# EAGLE design Main-v6.0 copy (EAGLE 9.5.2)
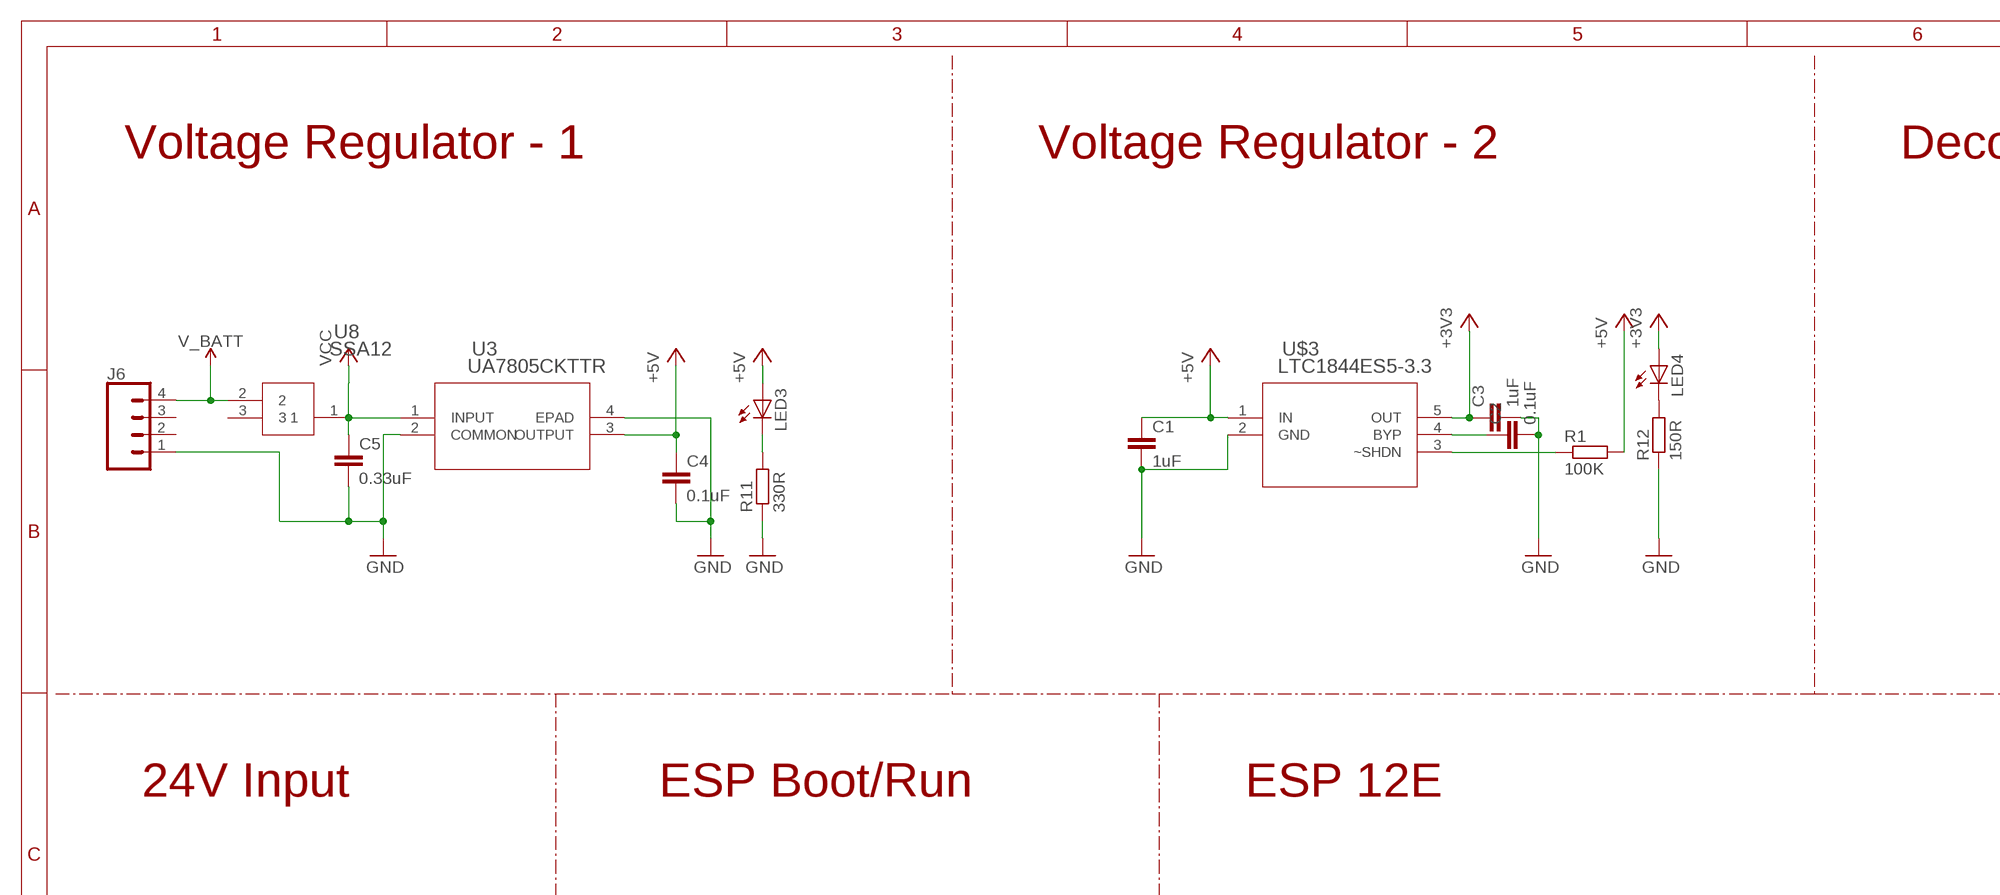
[diagram p0: schematic, sheet 1, part 1 of 3]
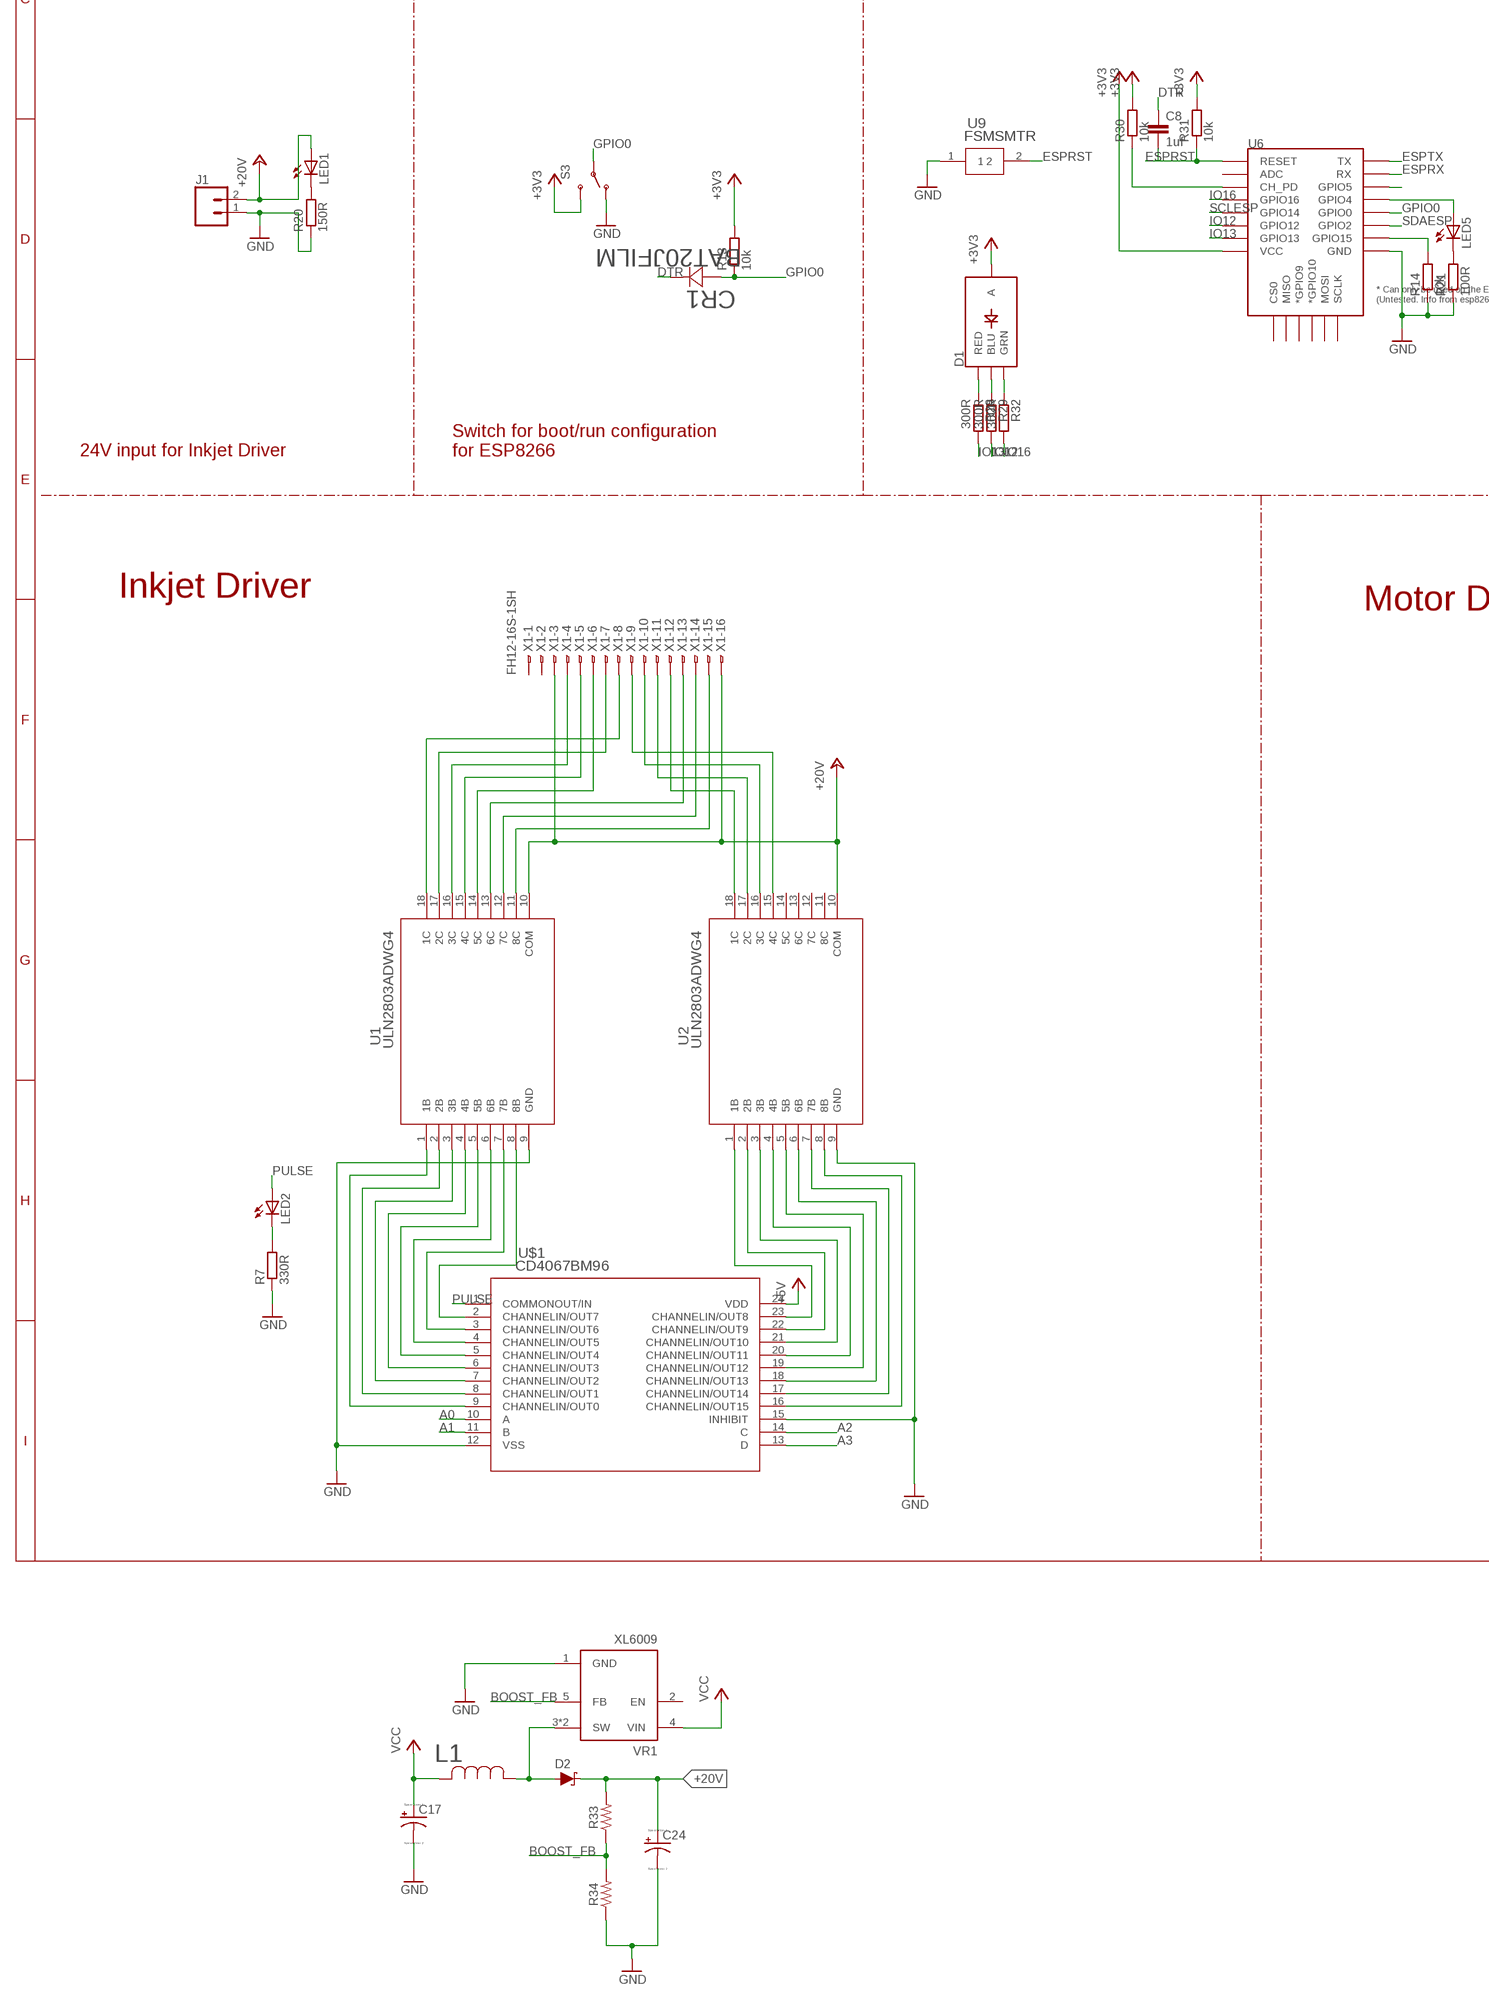
[diagram p1: schematic, sheet 1, part 2 of 3]
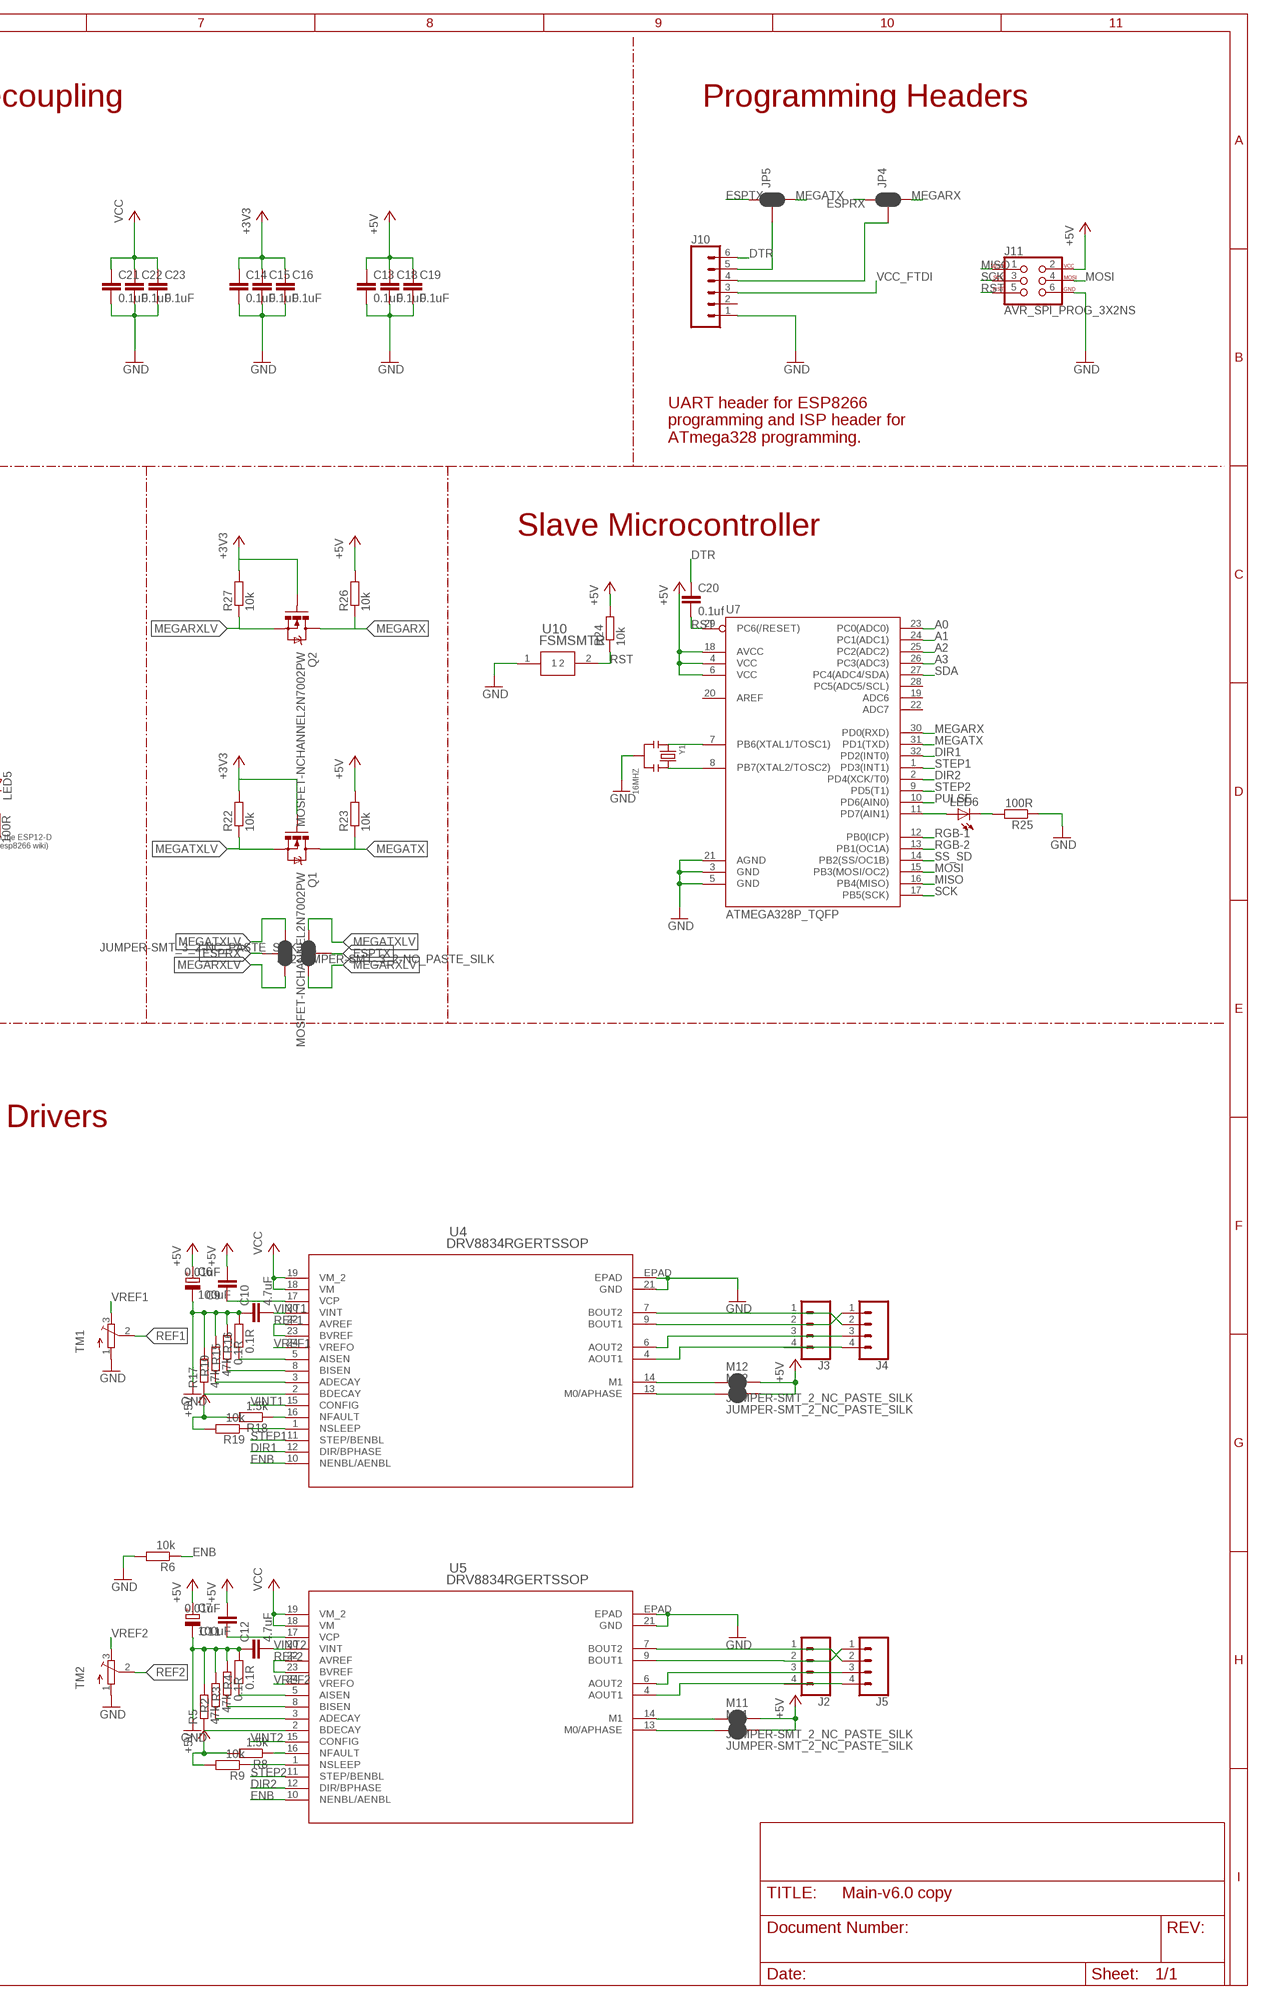
[diagram p2: schematic, sheet 1, part 3 of 3]

## Parts
C1  1uF  C-EUC0603  [C0603]
C2  0.1uF  C-EUC0603  [C0603]
C3  1uF  C-EUC0603  [C0603]
C4  0.1uF  C-EUC0603  [C0603]
C5  0.33uF  C-EUC0603  [C0603]
C6  100uF  CPOL-EUE5-5  [E5-5]
C7  100uF  CPOL-EUE5-5  [E5-5]
C8  1uf  C-EUC0603  [C0603]
C9  0.01uF  C-EUC0603K  [C0603K]
C10  4.7uF  C-EUC0603K  [C0603K]
C11  0.01uF  C-EUC0603K  [C0603K]
C12  4.7uF  C-EUC0603K  [C0603K]
C13  0.1uF  C-EUC0603  [C0603]
C14  0.1uF  C-EUC0603  [C0603]
C15  0.1uF  C-EUC0603  [C0603]
C16  0.1uF  C-EUC0603  [C0603]
C17  220uF  CPOL-USG  [PANASONIC_G]
C18  0.1uF  C-EUC0603  [C0603]
C19  0.1uF  C-EUC0603  [C0603]
C20  0.1uf  C-EUC0603  [C0603]
C21  0.1uF  C-EUC0603  [C0603]
C22  0.1uF  C-EUC0603  [C0603]
C23  0.1uF  C-EUC0603  [C0603]
C24  100uF  CPOL-USD  [PANASONIC_D]
CR1  BAT20JFILM  [SOD-323]
D1  LED-RGB-CASMD  [LED-TRICOLOR-SMD]
D2  3A/40V/500mV  DIODE-SCHOTTKY-B340A  [SMA-DIODE]
J1  CONN_02  [1X02]
J2  CONN_04  [1X04]
J3  CONN_04  [1X04]
J4  CONN_04  [1X04]
J5  CONN_04  [1X04]
J6  CONN_04  [1X04]
J10  CONN_06NO_SILK_NO_POP  [1X06_NO_SILK]
J11  AVR_SPI_PROG_3X2NS  [2X3-NS]
JP1  JUMPER-SMT_3_2-NC_PASTE_SILK  [SMT-JUMPER_3_2-NC_PASTE_SILK]
JP2  JUMPER-SMT_3_2-NC_PASTE_SILK  [SMT-JUMPER_3_2-NC_PASTE_SILK]
JP4  JUMPER-SMT_3_2-NC_PASTE_SILK  [SMT-JUMPER_3_2-NC_PASTE_SILK]
JP5  JUMPER-SMT_3_2-NC_PASTE_SILK  [SMT-JUMPER_3_2-NC_PASTE_SILK]
L1  SRR1210-680M  [IND_BOURNS_SRR1210]
LED1  LEDSML0603  [SML0603]
LED2  LEDSML0603  [SML0603]
LED3  LEDSML0603  [SML0603]
LED4  LEDSML0603  [SML0603]
LED5  LEDSML0603  [SML0603]
LED6  LEDSML0603  [SML0603]
M01  JUMPER-SMT_2_NC_PASTE_SILK  [SMT-JUMPER_2_NC_PASTE_SILK]
M02  JUMPER-SMT_2_NC_PASTE_SILK  [SMT-JUMPER_2_NC_PASTE_SILK]
M11  JUMPER-SMT_2_NC_PASTE_SILK  [SMT-JUMPER_2_NC_PASTE_SILK]
M12  JUMPER-SMT_2_NC_PASTE_SILK  [SMT-JUMPER_2_NC_PASTE_SILK]
Q1  MOSFET-NCHANNEL2N7002PW  [SOT323]
Q2  MOSFET-NCHANNEL2N7002PW  [SOT323]
R1  100K  R-EU_R0603  [R0603]
R2  47k  R-EU_R0402  [R0402]
R3  0.1R  R-EU_R0402  [R0402]
R4  0.1R  R-EU_R0402  [R0402]
R5  47k  R-EU_R0402  [R0402]
R6  10k  R-EU_R0402  [R0402]
R7  330R  R-EU_R0603  [R0603]
R8  1.5k  R-EU_R0402  [R0402]
R9  10k  R-EU_R0402  [R0402]
R10  47k  R-EU_R0402  [R0402]
R11  330R  R-EU_R0603  [R0603]
R12  150R  R-EU_R0603  [R0603]
R13  10k  R-EU_R0603  [R0603]
R14  10k  R-EU_R0603  [R0603]
R15  0.1R  R-EU_R0402  [R0402]
R16  0.1R  R-EU_R0402  [R0402]
R17  47k  R-EU_R0402  [R0402]
R18  1.5k  R-EU_R0402  [R0402]
R19  10k  R-EU_R0402  [R0402]
R20  150R  R-EU_R0603  [R0603]
R21  100R  R-EU_R0603  [R0603]
R22  10k  R-EU_R0603  [R0603]
R23  10k  R-EU_R0603  [R0603]
R24  10k  R-EU_R0603  [R0603]
R25  100R  R-EU_R0603  [R0603]
R26  10k  R-EU_R0603  [R0603]
R27  10k  R-EU_R0603  [R0603]
R28  300R  R-EU_R0603  [R0603]
R29  300R  R-EU_R0603  [R0603]
R30  10k  R-EU_R0603  [R0603]
R31  10k  R-EU_R0603  [R0603]
R32  300R  R-EU_R0603  [R0603]
R33  RESISTOR0603  [0603]
R34  RESISTOR0603  [0603]
S3  SWITCH-SPDT-SMD-A  [SWITCH-SPST-SMD-A]
TM1  TRIMPOTTC33X  [TC33X]
TM2  TRIMPOTTC33X  [TC33X]
U1  ULN2803ADWG4  [DW18]
U2  ULN2803ADWG4  [DW18]
U3  UA7805CKTTR  [KTT3_6P22X6P6]
U4  DRV8834RGERTSSOP  [PWP_24]
U5  DRV8834RGERTSSOP  [PWP_24]
U6  ESP12ESMD  [ESP12E-SMD]
U7  ATMEGA328P_TQFP  [TQFP32-08]
U8  SSA12  [SWSIP3-P98]
U9  FSMSMTR  [SWITCH_FSMSMTR]
U10  FSMSMTR  [SWITCH_FSMSMTR]
U$1  CD4067BM96  [DW24]
U$3  LTC1844ES5-3.3  [TSOT-23_S5]
VR1  XL6009  [DPAK170P1435X465-6N]
X1  FH12-16S-1SH  [FH12-16S-1SH]
Y1  16MHZ  SMD-RESONATOR-16MHZ-15PF-0.5%-40R(3P-3.2X1.3MM)  [X3-SMD-3.6X1.3X0.8MM]

## Nets
+3V3: C3.1 C14.1 C15.1 C16.1 D1.A LED4.A Q1.1(G) Q2.1(G) R13.2 R22.2 R27.2 R30.2 R31.2 S3.3(S) U6.VCC U$3.5(OUT)
+5V: C1.1 C4.1 C6.+ C7.+ C9.2 C11.2 C13.1 C18.1 C19.1 J11.2 LED3.A M01.2 M02.2 M11.2 M12.2 R1.2 R8.2 R9.2 R18.2 R19.2 R23.2 R24.2 R26.2 U3.3(OUTPUT) U7.4(VCC) U7.6(VCC) U7.18(AVCC) U$1.24(VDD) U$3.1(IN)
+20V: C24.+ D2.C R33.2
+24V: J1.2 LED1.A U1.10(COM) U2.10(COM) X1.3 X1.16 ; supply symbol labelled +20V
A0: U7.23(PC0(ADC0)) U$1.10(A)
A1: U7.24(PC1(ADC1)) U$1.11(B)
A2: U7.25(PC2(ADC2)) U$1.14(C)
A3: U7.26(PC3(ADC3)) U$1.13(D)
BOOST_FB: R33.1 R34.2 VR1.5(FB)
DIR1: U4.12(DIR/BPHASE) U7.32(PD2(INT0))
DIR2: U5.12(DIR/BPHASE) U7.2(PD4(XCK/T0))
DTR: C8.1 C20.1 CR1.1 J10.6
ENB: R6.1 U4.10(NENBL/AENBL) U5.10(NENBL/AENBL)
ESPRST: C8.2 R31.1 U6.RESET U9.2
ESPRX: JP1.2 JP4.1 U6.RXD0(RX)
ESPTX: JP2.2 JP5.1 U6.TXD0(TX)
GND: C1.2 C2.2 C3.2 C4.2 C5.2 C6.- C7.- C10.1 C12.1 C13.2 C14.2 C15.2 C16.2 C17.- C18.2 C19.2 C21.2 C22.2 C23.2 C24.- J1.1 J6.1 J10.1 J11.6 R2.2 R3.2 R4.2 R5.2 R6.2 R7.1 R10.2 R11.1 R12.1 R14.1 R15.2 R16.2 R17.2 R20.1 R21.1 R25.1 R34.1 S3.1(O) TM1.1(A) TM2.1(A) U1.9(GND) U2.9(GND) U3.2(COMMON) U3.4(EPAD) U4.21(GND) U4.EPAD U5.21(GND) U5.EPAD U6.GND U7.3(GND) U7.5(GND) U7.21(AGND) U9.1 U10.1 U$1.12(VSS) U$1.15(INHIBIT) U$3.2(GND) VR1.1(GND) Y1.2
GPIO0: CR1.2 R13.1 S3.2(P) U6.GPIO0
IO12: R29.2 U6.GPIO12
IO13: R28.2 U6.GPIO13
IO16: R32.2 U6.GPIO16
MEGARX: JP4.3 Q2.3(D) R26.1 U7.30(PD0(RXD))
MEGARXLV: JP1.3 JP2.1 Q2.2(S) R27.1
MEGATX: JP5.3 Q1.3(D) R23.1 U7.31(PD1(TXD))
MEGATXLV: JP1.1 JP2.3 Q1.2(S) R22.1
MISO: J11.1 U7.16(PB4(MISO))
MOSI: J11.4 U7.15(PB3(MOSI/OC2))
N$1: D2.A L1.1 VR1.3(SW) VR1.6(SW)
N$3: U1.8(8B) U$1.2(CHANNELIN/OUT7)
N$4: U1.7(7B) U$1.3(CHANNELIN/OUT6)
N$5: U1.6(6B) U$1.4(CHANNELIN/OUT5)
N$6: U1.5(5B) U$1.5(CHANNELIN/OUT4)
N$7: U1.4(4B) U$1.6(CHANNELIN/OUT3)
N$8: U1.3(3B) U$1.7(CHANNELIN/OUT2)
N$9: U1.2(2B) U$1.8(CHANNELIN/OUT1)
N$10: U1.1(1B) U$1.9(CHANNELIN/OUT0)
N$11: U2.1(1B) U$1.23(CHANNELIN/OUT8)
N$12: U2.2(2B) U$1.22(CHANNELIN/OUT9)
N$13: U2.3(3B) U$1.21(CHANNELIN/OUT10)
N$14: U2.4(4B) U$1.20(CHANNELIN/OUT11)
N$15: U2.5(5B) U$1.19(CHANNELIN/OUT12)
N$16: U2.6(6B) U$1.18(CHANNELIN/OUT13)
N$17: J3.1 J4.2 U4.7(BOUT2)
N$18: J3.2 J4.1 U4.9(BOUT1)
N$19: J3.3 J4.3 U4.6(AOUT2)
N$20: J3.4 J4.4 U4.4(AOUT1)
N$21: U1.11(8C) X1.15
N$22: U1.12(7C) X1.14
N$23: U1.13(6C) X1.13
N$24: U1.14(5C) X1.6
N$25: U1.15(4C) X1.5
N$26: U1.16(3C) X1.4
N$27: U1.17(2C) X1.7
N$28: U1.18(1C) X1.8
N$29: U2.8(8B) U$1.16(CHANNELIN/OUT15)
N$30: U2.18(1C) X1.12
N$31: U2.17(2C) X1.11
N$32: U2.16(3C) X1.10
N$33: U2.15(4C) X1.9
N$34: U2.7(7B) U$1.17(CHANNELIN/OUT14)
N$35: J2.1 J5.2 U5.7(BOUT2)
N$36: J2.2 J5.1 U5.9(BOUT1)
N$38: C2.1 U$3.4(BYP)
N$39: R1.1 U$3.3(~SHDN)
N$40: J2.3 J5.3 U5.6(AOUT2)
N$41: J2.4 J5.4 U5.4(AOUT1)
N$42: C11.1 U5.17(VCP)
N$43: R5.1 U5.2(BDECAY)
N$44: R2.1 U5.3(ADECAY)
N$45: LED2.C R7.2
N$46: R3.1 U5.8(BISEN)
N$47: R4.1 U5.5(AISEN)
N$48: R9.1 U5.1(NSLEEP)
N$49: R8.1 U5.16(NFAULT)
N$50: LED3.C R11.2
N$51: LED4.C R12.2
N$52: R30.1 U6.CH_PD
N$54: R17.1 U4.2(BDECAY)
N$55: LED6.C R25.2
N$56: LED5.C R21.2
N$57: LED6.A U7.11(PD7(AIN1))
N$58: U7.8(PB7(XTAL2/TOSC2)) Y1.3
N$59: U7.7(PB6(XTAL1/TOSC1)) Y1.1
N$60: D1.R(RED) R28.1
N$61: D1.B(BLU) R29.1
N$62: D1.G(GRN) R32.1
N$65: R10.1 U4.3(ADECAY)
N$66: R15.1 U4.8(BISEN)
N$67: R16.1 U4.5(AISEN)
N$68: C9.1 U4.17(VCP)
N$72: J10.4 JP4.2
N$73: R19.1 U4.1(NSLEEP)
N$74: R18.1 U4.16(NFAULT)
N$75: M01.1 U5.13(M0/APHASE)
N$76: M11.1 U5.14(M1)
N$77: M02.1 U4.13(M0/APHASE)
N$78: M12.1 U4.14(M1)
N$79: LED1.C R20.2
N$80: LED5.A U6.GPIO4
N$81: J10.5 JP5.2
N$84: R14.2 U6.GPIO15
N$91: U6.GPIO5
PULSE: LED2.A U7.10(PD6(AIN0)) U$1.1(COMMONOUT/IN)
REF1: TM1.2(S) U4.22(AVREF) U4.23(BVREF)
REF2: TM2.2(S) U5.22(AVREF) U5.23(BVREF)
RGB-1: U7.12(PB0(ICP))
RGB-2: U7.13(PB1(OC1A))
RST: C20.2 J11.5 R24.1 U7.29(PC6(/RESET)) U10.2
SCK: J11.3 U7.17(PB5(SCK))
SCLESP: U6.GPIO14
SDA: U7.27(PC4(ADC4/SDA))
SDAESP: U6.GPIO2
SS_SD: U7.14(PB2(SS/OC1B))
STEP1: U4.11(STEP/BENBL) U7.1(PD3(INT1))
STEP2: U5.11(STEP/BENBL) U7.9(PD5(T1))
V_BATT: J6.4 U8.2
VCC: C5.1 C17.+ C21.1 C22.1 C23.1 L1.2 U3.1(INPUT) U4.18(VM) U4.19(VM_2) U5.18(VM) U5.19(VM_2) U8.1 VR1.4(VIN)
VCC_FTDI: J10.3
VINT1: C10.2 U4.15(CONFIG) U4.20(VINT)
VINT2: C12.2 U5.15(CONFIG) U5.20(VINT)
VREF1: TM1.3(E) U4.24(VREFO)
VREF2: TM2.3(E) U5.24(VREFO)
Unconnected: J6.2 J6.3 J10.2 U2.11(8C) U2.12(7C) U2.13(6C) U2.14(5C) U6.ADC U6.CS0 U6.GPIO9(*GPIO9) U6.GPIO10(*GPIO10) U6.MISO U6.MOSI U6.SCLK U7.19(ADC6) U7.20(AREF) U7.22(ADC7) U7.28(PC5(ADC5/SCL)) U8.3 VR1.2(EN) X1.1 X1.2

## Notes on the sheet
- Voltage Regulator - 1 | Voltage Regulator - 2 | Decoupling | Programming Headers
- UART header for ESP8266
  programming and ISP header for
  ATmega328 programming.
- 24V Input | ESP Boot/Run | ESP 12E | Slave Microcontroller
- 24V input for Inkjet Driver
- Switch for boot/run configuration
  for ESP8266
- Inkjet Driver
- Motor Drivers

## Library data of the parts
C1-C5 C8-C16 C18-C23 = resistor:C-EU: CAPACITOR, European symbol
C6 C7 = resistor:CPOL-EU: POLARIZED CAPACITOR, European symbol
C17 C24 = resistor:CPOL-US: POLARIZED CAPACITOR, American symbol
CR1 = Beeclust:BAT20JFILM; MANUFACTURER_PART_NUMBER: BAT20JFILM; VENDOR: ST Microelectronics
D1 = SparkFun-LED:LED-RGB-CA: LED-RGB Diffused Common Anode Packages: LED RGB-THRU P-LCC-4-3 LED-TRICOLOR-SMD SparkFun Products: RGB Diffused Common Anode- Diffuse <[https://www.sparkfun.com/products/10821]> RGB Diffused Common Anode - Clear <[https://www.sparkfun.com/products/10820]> Qduino Mini <[https://www.sparkfun.com/products/13614]> Triple Output LED RGB - SMD <https://www.sparkfun.com/products/7844>; PROD_ID: DIO-08324
D2 = SparkFun-DiscreteSemi:DIODE-SCHOTTKY: Schottky diode A Schottky diode is a semiconductor diode which has a low forward voltage drop and a very fast switching action.; PROD_ID: DIO-09886
J1 = SparkFun-Connectors:CONN_02: Multi connection point. Often used as Generic Header-pin footprint for 0.1 inch spaced/style header connections On any of the 0.1 inch spaced packages, you can populate with these: Break Away Headers - Straight <https://www.sparkfun.com/products/116> (PRT-00116) Break Away Male Headers - Right Angle <https://www.sparkfun.com/products/553> (PRT-00553) Female Headers <https://www.sparkfun.com/products/115> (PRT-00115) Break Away Headers - Machine Pin <https://www.sparkfun.com/products/117> (PRT-00117) Break Away Female Headers - Swiss Machine Pin <https://www.sparkfun.com/products/743> (PRT-00743) For SCREWTERMINALS and SPRING TERMINALS visit here: Screw Terimnals on SparkFun.com <https://www.sparkfun.com/search/results?term=Screw+Terminals> (5mm/3.5mm/2.54mm spacing) This device is also useful as a general connection point to wire up your design to another part of your project. Our various solder wires solder well into these plated through hole pads. Hook-Up Wire - Assortment (Stranded, 22 AWG) <https://www.sparkfun.com/products/11375> (PRT-11375) Hook-Up Wire - Assortment (Solid Core, 22 AWG) <https://www.sparkfun.com/products/11367> (PRT-11367) View the entire wire category on our website here <https://www.sparkfun.com/categories/141> Special notes: Molex polarized connector foot print use with: PRT-08233 with associated crimp pins and housings. 2.54_SCREWTERM for use with PRT-10571. 3.5mm Screw Terminal footprints for PRT-08084 5mm Screw Terminal footprints for use with PRT-08432
J2-J6 = SparkFun-Connectors:CONN_04: Multi connection point. Often used as Generic Header-pin footprint for 0.1 inch spaced/style header connections On any of the 0.1 inch spaced packages, you can populate with these: Break Away Headers - Straight <https://www.sparkfun.com/products/116> (PRT-00116) Break Away Male Headers - Right Angle <https://www.sparkfun.com/products/553> (PRT-00553) Female Headers <https://www.sparkfun.com/products/115> (PRT-00115) Break Away Headers - Machine Pin <https://www.sparkfun.com/products/117> (PRT-00117) Break Away Female Headers - Swiss Machine Pin <https://www.sparkfun.com/products/743> (PRT-00743) For SCREWTERMINALS and SPRING TERMINALS visit here: Screw Terimnals on SparkFun.com <https://www.sparkfun.com/search/results?term=Screw+Terminals> (5mm/3.5mm/2.54mm spacing) This device is also useful as a general connection point to wire up your design to another part of your project. Our various solder wires solder well into these plated through hole pads. Hook-Up Wire - Assortment (Stranded, 22 AWG) <https://www.sparkfun.com/products/11375> (PRT-11375) Hook-Up Wire - Assortment (Solid Core, 22 AWG) <https://www.sparkfun.com/products/11367> (PRT-11367) View the entire wire category on our website here <https://www.sparkfun.com/categories/141> Special notes: Molex polarized connector foot print use with SKU : PRT-08231 with associated crimp pins and housings. 1MM SMD Version SKU: PRT-10208; PROD_ID: CONN-09696
J10 = SparkFun-Connectors:CONN_06: Multi connection point. Often used as Generic Header-pin footprint for 0.1 inch spaced/style header connections On any of the 0.1 inch spaced packages, you can populate with these: Break Away Headers - Straight <https://www.sparkfun.com/products/116> (PRT-00116) Break Away Male Headers - Right Angle <https://www.sparkfun.com/products/553> (PRT-00553) Female Headers <https://www.sparkfun.com/products/115> (PRT-00115) Break Away Headers - Machine Pin <https://www.sparkfun.com/products/117> (PRT-00117) Break Away Female Headers - Swiss Machine Pin <https://www.sparkfun.com/products/743> (PRT-00743) Arduino Stackable Header - 6 Pin <https://www.sparkfun.com/products/9280> (PRT-09280) For SCREWTERMINALS and SPRING TERMINALS visit here: Screw Terimnals on SparkFun.com <https://www.sparkfun.com/search/results?term=Screw+Terminals> (5mm/3.5mm/2.54mm spacing) This device is also useful as a general connection point to wire up your design to another part of your project. Our various solder wires solder well into these plated through hole pads. Hook-Up Wire - Assortment (Stranded, 22 AWG) <https://www.sparkfun.com/products/11375> (PRT-11375) Hook-Up Wire - Assortment (Solid Core, 22 AWG) <https://www.sparkfun.com/products/11367> (PRT-11367) View the entire wire category on our website here <https://www.sparkfun.com/categories/141>
J11 = SparkFun-Connectors:AVR_SPI_PROG_3X2: AVR ISP 6 Pin This is the reduced ISP connector for AVR programming. Common on Arduino. This footprint will take up less PCB space and can be used with a 10-pin to 6-pin adapter such as SKU: BOB-08508 **Special note about "TEST_POINT" package. The stop mask is on the top side, so if you want your programming test points to be on the bottom of your board, make sure to place this package on the bottom side of the board. This also ensure that the orientation to program from the bottom side will be correct. SparkFun Products: SparkFun ISP Pogo Adapter <https://www.sparkfun.com/products/11591> - NS Tiny AVR Programmer <https://www.sparkfun.com/products/11801> -PTH
JP1 JP2 JP4 JP5 = SparkFun-Jumpers:JUMPER-SMT_3_2-NC_PASTE: Normally closed solder jumper (2 of 2 connections) This jumper has an aperture in the stencil to allow solder paste to bridge both connections. Both connections are normally closed (NC). Wick off the solder to open the connection(s). Reapply solder to reclose the connection(s).
L1 = 12MM Inductor:SRR1210-680M; BUILT_BY: EMA_UL_Team; MANUFACTURER_PART_NUMBER: SRR1210-680M; VENDOR: Bourns Electronics
LED1-LED6 = led:LED: LED OSRAM: - CHIPLED LG R971, LG N971, LY N971, LG Q971, LY Q971, LO R971, LY R971 LH N974, LH R974 LS Q976, LO Q976, LY Q976 LO Q996 - Hyper CHIPLED LW Q18S LB Q993, LB Q99A, LB R99A - SideLED LS A670, LO A670, LY A670, LG A670, LP A670 LB A673, LV A673, LT A673, LW A673 LH A674 LY A675 LS A676, LA A676, LO A676, LY A676, LW A676 LS A679, LY A679, LG A679 - Hyper Micro SIDELED® LS Y876, LA Y876, LO Y876, LY Y876 LT Y87S - SmartLED LW L88C, LW L88S LB L89C, LB L89S, LG L890 LS L89K, LO L89K, LY L89K LS L896, LA L896, LO L896, LY L896 - TOPLED LS T670, LO T670, LY T670, LG T670, LP T670 LSG T670, LSP T670, LSY T670, LOP T670, LYG T670 LG T671, LOG T671, LSG T671 LB T673, LV T673, LT T673, LW T673 LH T674 LS T676, LA T676, LO T676, LY T676, LB T676, LH T676, LSB T676, LW T676 LB T67C, LV T67C, LT T67C, LS T67K, LO T67K, LY T67K, LW E67C LS E67B, LA E67B, LO E67B, LY E67B, LB E67C, LV E67C, LT E67C LW T67C LS T679, LY T679, LG T679 LS T770, LO T770, LY T770, LG T770, LP T770 LB T773, LV T773, LT T773, LW T773 LH T774 LS E675, LA E675, LY E675, LS T675 LS T776, LA T776, LO T776, LY T776, LB T776 LHGB T686 LT T68C, LB T68C - Hyper Mini TOPLED® LB M676 - Mini TOPLED Santana® LG M470 LS M47K, LO M47K, LY M47K Source: http://www.osram.convergy.de LUXEON: - LUMILED® LXK2-PW12-R00, LXK2-PW12-S00, LXK2-PW14-U00, LXK2-PW14-V00 LXK2-PM12-R00, LXK2-PM12-S00, LXK2-PM14-U00 LXK2-PE12-Q00, LXK2-PE12-R00, LXK2-PE12-S00, LXK2-PE14-T00, LXK2-PE14-U00 LXK2-PB12-K00, LXK2-PB12-L00, LXK2-PB12-M00, LXK2-PB14-N00, LXK2-PB14-P00, LXK2-PB14-Q00 LXK2-PR12-L00, LXK2-PR12-M00, LXK2-PR14-Q00, LXK2-PR14-R00 LXK2-PD12-Q00, LXK2-PD12-R00, LXK2-PD12-S00 LXK2-PH12-R00, LXK2-PH12-S00 LXK2-PL12-P00, LXK2-PL12-Q00, LXK2-PL12-R00 Source: www.luxeon.com KINGBRIGHT: KA-3528ASYC Source: www.kingbright.com
M01 M02 M11 M12 = SparkFun-Jumpers:JUMPER-SMT_2_NC_PASTE: Normally closed solder jumper This jumper has an aperture in the stencil to allow solder paste to bridge the split in the wire so it's normally closed (NC). Wick off the solder to open the connection. Reapply solder to reclose the connection.
Q1 Q2 = SparkFun-DiscreteSemi:MOSFET-NCHANNEL: Common NMOSFET Parts MFG P/N Store ID Prod ID FDD8780 TRANS-09984 SI7820DN TRANS-11055 FDS6630A IC-08089 2N7002PW TRANS-11151 FQP30N06L COM-10213 TRANS-10060 BSS123LT1G TRANS-08345 BSS138 TRANS-00830 BS170 2N7000; PROD_ID: TRANS-11151
R1-R32 = resistor:R-EU_: RESISTOR, European symbol
R33 R34 = SparkFun-Resistors:RESISTOR: Generic Resistor Package
S3 = SparkFun-Electromechanical:SWITCH-SPDT: SPDT Switch Simple slide switch, Spark Fun Electronics SKU : COM-00102 DPDT SMT slide switch, AYZ0202, SWCH-08179; PROD_ID: SWCH-10651
TM1 TM2 = adafruit:TRIMPOT: SMT trimmer potentiometer part number TC33X http://www.ladyada.net/library/eagle
U1 U2 = Beeclust:ULN2803ADWG4; MANUFACTURER_PART_NUMBER: ULN2803ADWG4; VENDOR: Texas Instruments
U3 = Beeclust:UA7805CKTTR; MANUFACTURER_PART_NUMBER: UA7805CKTTR; VENDOR: Texas Instruments
U4 U5 = Beeclust:DRV8834RGER
U6 = esp8266modules:ESP12E: ESP12E Module
U7 = SparkFun-IC-Microcontroller:ATMEGA328P_TQFP: Popular 328P in QFP Storefront component: ATmega328 - TQFP <https://www.sparkfun.com/products/13448> (COM-13448) Datasheet <http://www.sparkfun.com/datasheets/Components/SMD/ATMega328.pdf> SparkFun Products SparkFun RedBoard - Programmed with Arduino <https://www.sparkfun.com/products/12757> (DEV-12757) Arduino Pro Mini 328 - 5V/16MHz <https://www.sparkfun.com/products/11113> (DEV-11113) Arduino Pro Mini 328 - 3.3V/8MHz <https://www.sparkfun.com/products/11114> (DEV-11114) SparkFun OpenLog <https://www.sparkfun.com/products/13712> (DEV-13712) SparkFun MicroView - OLED Arduino Module <https://www.sparkfun.com/products/12923> (DEV-12923) SparkFun Digital Sandbox <https://www.sparkfun.com/products/12651> (DEV-12651) SparkFun PicoBoard <https://www.sparkfun.com/products/11888> (WIG-11888) Arduino Fio <https://www.sparkfun.com/products/10116> (DEV-10116) LilyPad Arduino 328 Main Board <https://www.sparkfun.com/products/13342> (DEV-13342) SparkFun RedStick <https://www.sparkfun.com/products/13741> (DEV-13741) LilyPad MP3 <https://www.sparkfun.com/products/11013> (DEV-11013) LilyPad Arduino SimpleSnap <https://www.sparkfun.com/products/10941> (DEV-10941) SparkFun Stepoko <https://www.sparkfun.com/products/13899> (ROB-13899) SparkFun Geiger Counter <https://www.sparkfun.com/products/11345> (SEN-11345) SparkFun EL Sequencer <https://www.sparkfun.com/products/12781> (COM-12781) Arduino Pro 328 - 5V/16MHz <https://www.sparkfun.com/products/10915> (DEV-10915) CryptoCape <https://www.sparkfun.com/products/12773> (DEV-12773) SparkFun IR Thermometer Evaluation Board - MLX90614 <https://www.sparkfun.com/products/10740> (SEN-10740) SparkFun RedBot Mainboard <https://www.sparkfun.com/products/12097> (ROB-12097) Arduino Pro 328 - 3.3V/8MHz <https://www.sparkfun.com/products/10914> (DEV-10914) SparkFun Block for Intel® Edison - Arduino <https://www.sparkfun.com/products/13036> (DEV-13036) SparkFun Simon Says - Surface Mount Soldering Kit <https://www.sparkfun.com/products/10935> (KIT-10935) SparkFun 7-Segment Serial Display - Red <https://www.sparkfun.com/products/11441> (COM-11441) SparkFun 7-Segment Serial Display - White <https://www.sparkfun.com/products/11629> (COM-11629) SparkFun 7-Segment Serial Display - Yellow <https://www.sparkfun.com/products/11443> (COM-11443) SparkFun 7-Segment Serial Display - Kelly Green <https://www.sparkfun.com/products/11440> (COM-11440) SparkFun 7-Segment Serial Display - Blue <https://www.sparkfun.com/products/11442> (COM-11442) SparkFun OpenSegment Serial Display - 20mm (Blue) <https://www.sparkfun.com/products/11647> (COM-11647) SparkFun OpenSegment Serial Display - 20mm (Green) <https://www.sparkfun.com/products/11646> (COM-11646) SparkFun OpenSegment Serial Display - 20mm (White) <https://www.sparkfun.com/products/11648> (COM-11648) SparkFun OpenSegment Serial Display - 20mm (Red) <https://www.sparkfun.com/products/11644> (COM-11644) SparkFun OpenSegment Serial Display - 20mm (Yellow) <https://www.sparkfun.com/products/11645> (COM-11645) SparkFun OpenSegment Shield <https://www.sparkfun.com/products/13190> (DEV-13190); PROD_ID: IC-09069
U8 = Beeclust:SSA12; MANUFACTURER_PART_NUMBER: SSA12; VENDOR: TE Connectivity
U9 U10 = Beeclust:FSMSMTR; MANUFACTURER_PART_NUMBER: FSMSMTR; VENDOR: TE Connectivity
U$1 = Beeclust:CD4067BM96; MANUFACTURER_PART_NUMBER: CD4067B_DW_24; VENDOR: Texas Instruments
U$3 = Beeclust:LTC1844ES5-3.3
VR1 = XL6009:XL6009: The XL6009 regulator is a wide input range, current mode, DC/DC converter which is capable of generating either positive or negative output voltages.; AVAILABILITY: Unavailable; DESCRIPTION: The XL6009 regulator is a wide input range, current mode, DC/DC converter which is capable of generating either positive or negative output voltages.; MF: XLSEMI; MP: XL6009; PACKAGE: Package Analog Devices; PRICE: None
X1 = con-hirose:FH12-16S-1S: 1mm Pitch Connectors For FPC/FFC Source: Data sheet <http://www.hirose.co.jp/cataloge_hp/e58605370.pdf>; OC_FARNELL: unknown; OC_NEWARK: unknown
Y1 = Seeed-Crystal Oscillator:SMD-RESONATOR-16MHZ-15PF-0.5%-40R(3P-3.2X1.3MM): 306030002; MPN: CSTCE16M0V53-R0

## Board
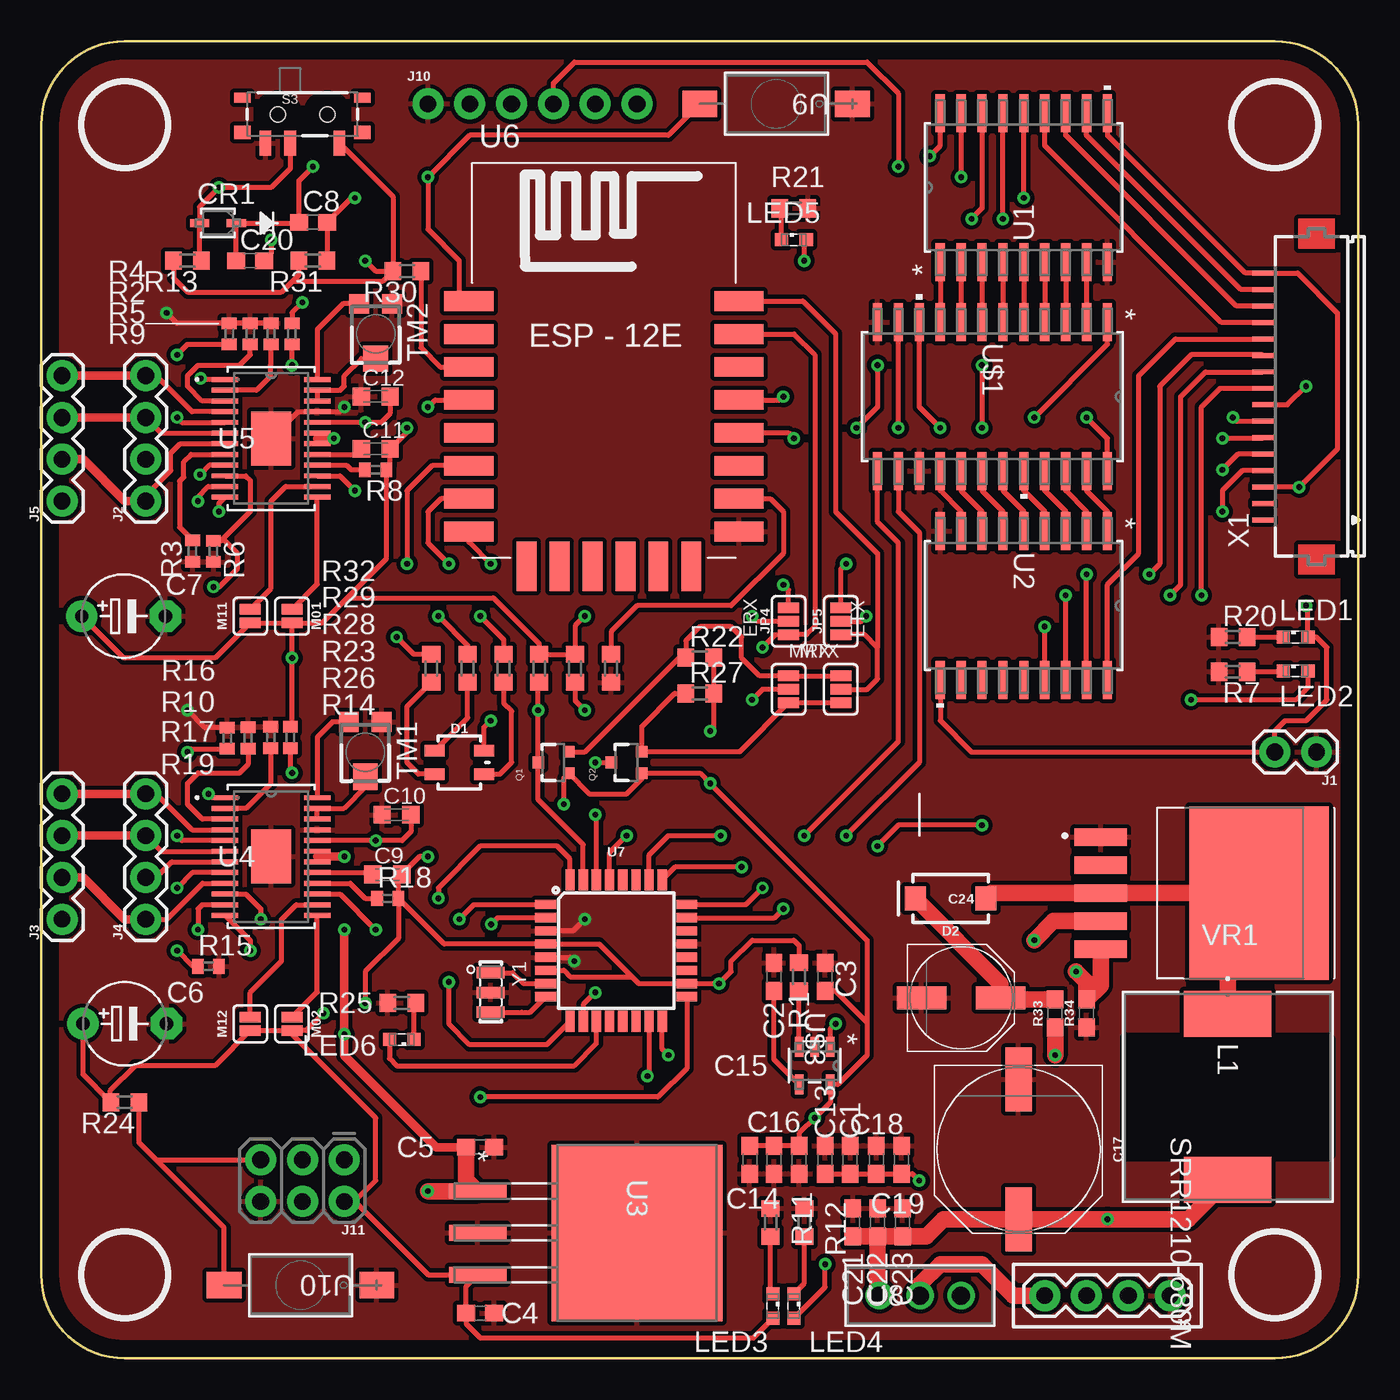
[diagram p3: board, top side]
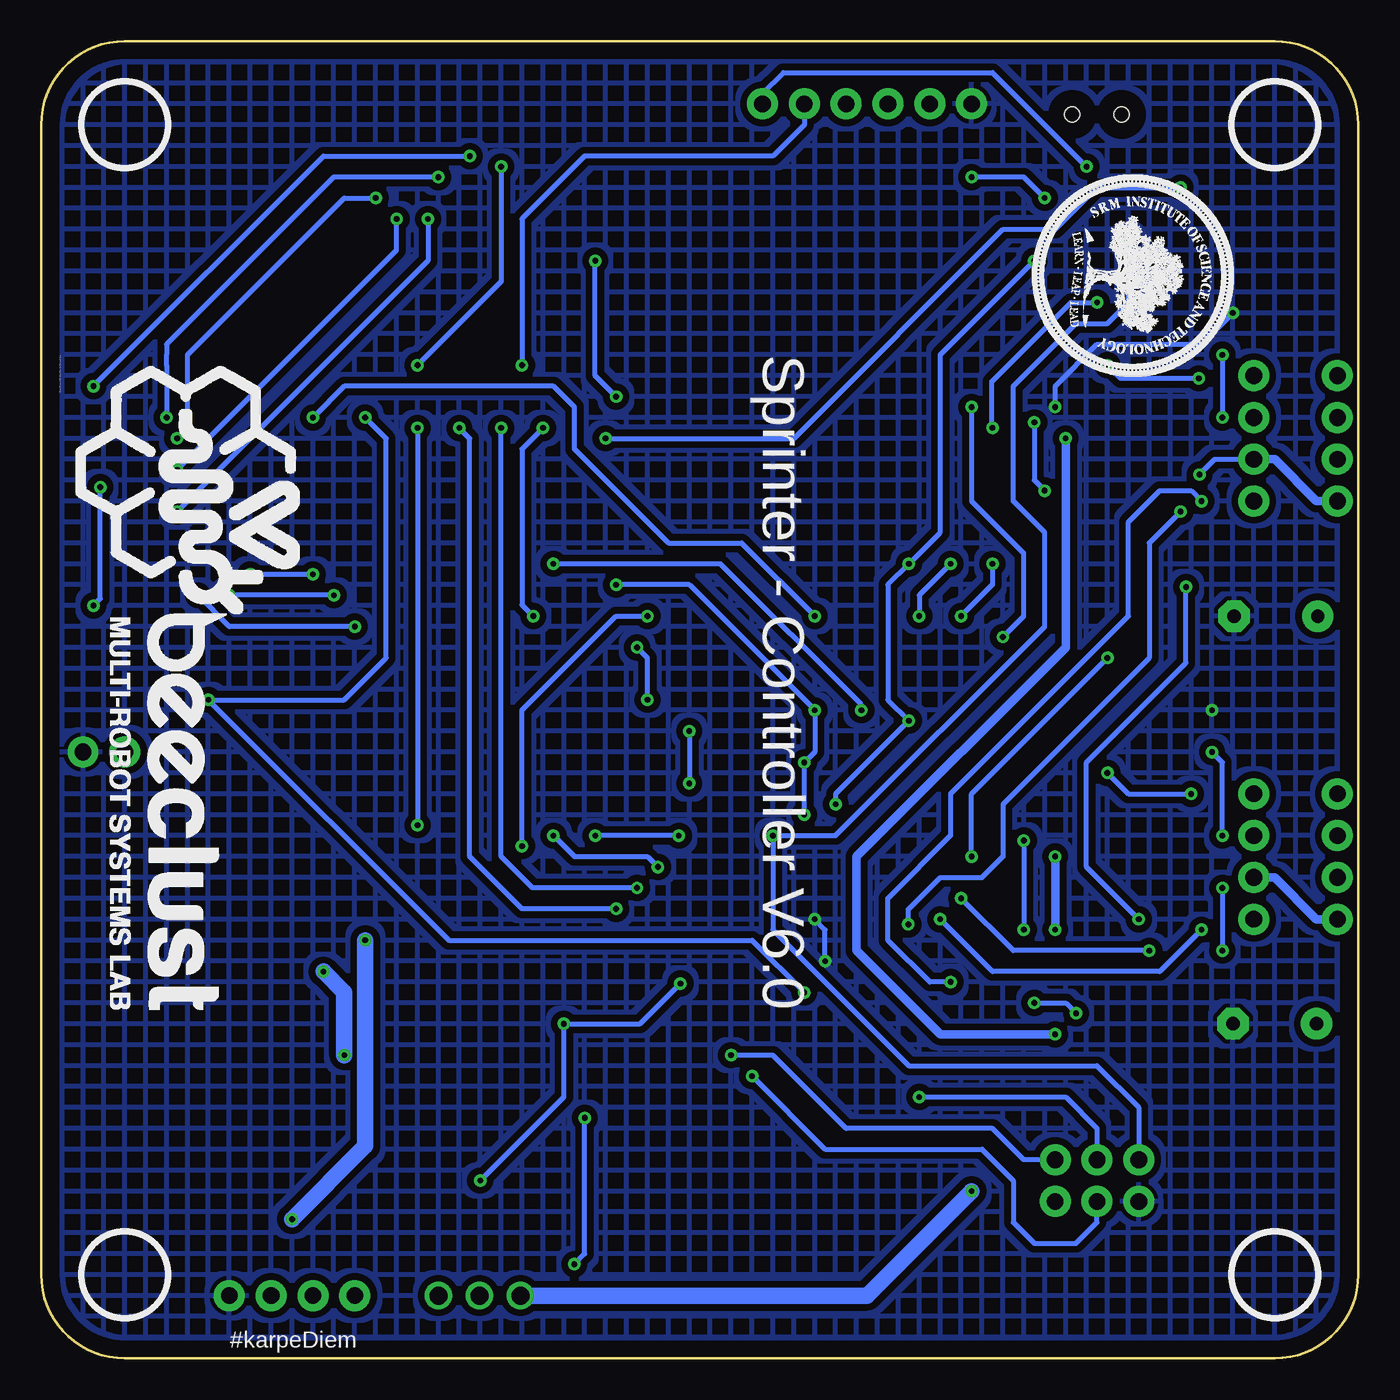
[diagram p4: board, bottom side, seen from below]

Size 80.01 x 80.01 mm. Coordinates in mm from the lower left corner, seen from the top.
Outline: 80.01,5.08 80.01,72.39
Outline: 80.01,5.08 80.01,74.93 arc90 74.93,80.01 5.08,80.01 arc90 0,74.93 0,5.08 arc90 5.08,0 74.93,0 arc90 80.01,5.08
Copper layers (1*16): Top 0.035mm / dielectric 1.5mm / Bottom 0.035mm
Design rules "default *": minimum track width 6mil, minimum drill 0.35mm, track to track 6mil, track to pad 6mil, pad to pad 6mil, via to via 6mil, smd to smd 6mil, copper to edge 40mil, drill to drill 6mil, minimum pad ring 10mil, minimum via ring 8mil, stop-mask expansion 4mil, vias tented up to drill 14mil, thermal gap 10mil

### Footprints (pad centres in the part's own frame; a part is rotated, then mirrored left to right if it is on the bottom)
C0603 = smd 1.1 x 1: 1 -0.85,0; 2 0.85,0
E5-5 = drill 0.813 pad 1.905: + -2.54,0 | drill 0.813 pad 1.905 octagon: - 2.54,0
C0603K = smd 1.05 x 1.08: 1 -0.875,0; 2 0.875,0
PANASONIC_G = smd 3.9 x 1.6: + 4.25,0; - -4.25,0
PANASONIC_D = smd 3 x 1.4: + 2.4,0; - -2.4,0
SOD-323 = smd 1.168 x 0.483: 1 -1.118,0; 2 1.118,0
LED-TRICOLOR-SMD = smd 1.2 x 0.7: A 1.5,0.7; B -1.5,0.7; G -1.5,-0.7; R 1.5,-0.7
SMA-DIODE = smd 1.27 x 1.47: A -2.15,0; C 2.15,0
1X02 = drill 1.016 pad 1.88: 1 0,0; 2 2.54,0
1X04 = drill 1.016 pad 1.88: 1 0,0; 2 2.54,0; 3 5.08,0; 4 7.62,0
1X06_NO_SILK = drill 1.016 pad 1.88: 1 0,0; 2 2.54,0; 3 5.08,0; 4 7.62,0; 5 10.16,0; 6 12.7,0
2X3-NS = drill 1.016 pad 1.88: 1 -2.54,-1.27; 2 -2.54,1.27; 3 0,-1.27; 4 0,1.27; 5 2.54,-1.27; 6 2.54,1.27
SMT-JUMPER_3_2-NC_PASTE_SILK = smd 0.635 x 1.27: 1 -0.813,0; 2 0,0; 3 0.813,0
IND_BOURNS_SRR1210 = smd 2.794 x 5.309: 1 -5.042,0; 2 5.042,0
SML0603 = smd 0.8 x 0.8: A 0.75,0; C -0.75,0
SMT-JUMPER_2_NC_PASTE_SILK = smd 0.635 x 1.27: 1 -0.406,0; 2 0.406,0
SOT323 = smd 0.7 x 0.7: 1 -0.65,-0.925; 2 0.65,-0.925; 3 0,0.925
R0603 = smd 1 x 1.1: 1 -0.85,0; 2 0.85,0
R0402 = smd 0.7 x 0.9: 1 -0.65,0; 2 0.65,0
0603 = smd 1.1 x 1: 1 -0.85,0; 2 0.85,0
SWITCH-SPST-SMD-A = smd 0.7 x 1.5: 1 -2.25,-1.75; 2 -0.75,-1.75; 3 2.25,-1.75 | smd 1 x 0.6: GND1 -3.65,1; GND3 3.65,1 | smd 1 x 0.8: GND2 -3.65,-1.1; GND4 3.65,-1.1 | hole 0.9: -1.5,0; 1.5,0
TC33X = smd 1.2 x 1.2: 1 -1,-1.825; 3 1,-1.825 | smd 1.5 x 1.6: 2 0,1.5
DW18 = smd 2.311 x 0.559: 1 -4.521,5.08; 2 -4.521,3.81; 3 -4.521,2.54; 4 -4.521,1.27; 5 -4.521,0; 6 -4.521,-1.27; 7 -4.521,-2.54; 8 -4.521,-3.81; 9 -4.521,-5.08; 10 4.521,-5.08; 11 4.521,-3.81; 12 4.521,-2.54; 13 4.521,-1.27; 14 4.521,0; 15 4.521,1.27; 16 4.521,2.54; 17 4.521,3.81; 18 4.521,5.08
KTT3_6P22X6P6 = smd 0.965 x 3.505: 1 -2.54,-9.677; 2 0,-9.677; 3 2.54,-9.677 | smd 10.719 x 10.363: 4 0,0
PWP_24 = smd 1.6 x 0.3: 1 -2.8,3.575; 2 -2.8,2.925; 3 -2.8,2.275; 4 -2.8,1.625; 5 -2.8,0.975; 6 -2.8,0.325; 7 -2.8,-0.325; 8 -2.8,-0.975; 9 -2.8,-1.625; 10 -2.8,-2.275; 11 -2.8,-2.925; 12 -2.8,-3.575; 13 2.8,-3.575; 14 2.8,-2.925; 15 2.8,-2.275; 16 2.8,-1.625; 17 2.8,-0.975; 18 2.8,-0.325; 19 2.8,0.325; 20 2.8,0.975; 21 2.8,1.625; 22 2.8,2.275; 23 2.8,2.925; 24 2.8,3.575 | smd 2.4 x 3.28: EPAD 0,0
ESP12E-SMD = smd 3 x 1.2: ADC -8.3,3.8; CH_PD -8.3,1.8; GND 8.1,-8.2; GPIO0 8.1,-2.2; GPIO2 8.1,-4.2; GPIO4 8.1,-0.2; GPIO5 8.1,1.8; GPIO12 -8.3,-4.2; GPIO13 -8.3,-6.2; GPIO14 -8.3,-2.2; GPIO15 8.1,-6.2; GPIO16 -8.3,-0.2; RESET -8.3,5.8; RXD0 8.1,3.8; TXD0 8.1,5.8; VCC -8.3,-8.2 | smd 1.2 x 3: CS0 -4.8,-10.3; GPIO9 -0.8,-10.3; GPIO10 1.2,-10.3; MISO -2.8,-10.3; MOSI 3.2,-10.3; SCLK 5.2,-10.3
TQFP32-08 = smd 1.27 x 0.559: 1 -4.293,2.8; 2 -4.293,2; 3 -4.293,1.2; 4 -4.293,0.4; 5 -4.293,-0.4; 6 -4.293,-1.2; 7 -4.293,-2; 8 -4.293,-2.8; 17 4.293,-2.8; 18 4.293,-2; 19 4.293,-1.2; 20 4.293,-0.4; 21 4.293,0.4; 22 4.293,1.2; 23 4.293,2; 24 4.293,2.8 | smd 0.559 x 1.27: 9 -2.8,-4.293; 10 -2,-4.293; 11 -1.2,-4.293; 12 -0.4,-4.293; 13 0.4,-4.293; 14 1.2,-4.293; 15 2,-4.293; 16 2.8,-4.293; 25 2.8,4.293; 26 2,4.293; 27 1.2,4.293; 28 0.4,4.293; 29 -0.4,4.293; 30 -1.2,4.293; 31 -2,4.293; 32 -2.8,4.293
SWSIP3-P98 = drill 1.092 pad 1.651: 1 -4.978,0; 2 -2.489,0; 3 0,0
SWITCH_FSMSMTR = smd 2.108 x 1.6: 1 -9.271,0; 2 0,0
DW24 = smd 2.311 x 0.559: 1 -4.521,6.985; 2 -4.521,5.715; 3 -4.521,4.445; 4 -4.521,3.175; 5 -4.521,1.905; 6 -4.521,0.635; 7 -4.521,-0.635; 8 -4.521,-1.905; 9 -4.521,-3.175; 10 -4.521,-4.445; 11 -4.521,-5.715; 12 -4.521,-6.985; 13 4.521,-6.985; 14 4.521,-5.715; 15 4.521,-4.445; 16 4.521,-3.175; 17 4.521,-1.905; 18 4.521,-0.635; 19 4.521,0.635; 20 4.521,1.905; 21 4.521,3.175; 22 4.521,4.445; 23 4.521,5.715; 24 4.521,6.985
TSOT-23_S5 = smd 1.219 x 0.508: 1 -1.143,0.95; 2 -1.143,0; 3 -1.143,-0.95; 4 1.143,-0.95; 5 1.143,0.95
DPAK170P1435X465-6N = smd 3.21 x 1.05: 1 -6.13,3.4; 2 -6.13,1.7; 3 -6.13,0; 4 -6.13,-1.7; 5 -6.13,-3.4 | smd 8.46 x 10.53: 6 3.5,0
FH12-16S-1SH = smd 0.3 x 1.3: 1 -7.5,3.25; 2 -6.5,3.25; 3 -5.5,3.25; 4 -4.5,3.25; 5 -3.5,3.25; 6 -2.5,3.25; 7 -1.5,3.25; 8 -0.5,3.25; 9 0.5,3.25; 10 1.5,3.25; 11 2.5,3.25; 12 3.5,3.25; 13 4.5,3.25; 14 5.5,3.25; 15 6.5,3.25; 16 7.5,3.25
X3-SMD-3.6X1.3X0.8MM = smd 0.7 x 1.7: 1 -1.2,0; 2 0,0; 3 1.2,0

### Placement (x,y rotation side)
C1  49.15,12.06 90 top
C2  44.51,23.18 90 top
C3  47.61,23.18 90 top
C4  26.67,2.74 0 top
C5  26.67,12.83 0 top
C6  5.08,20.32 0 top
C7  5,45.09 0 top
C8  16.51,69.01 0 top
C9  21.03,29.39 0 top
C10  21.59,33.02 0 top
C11  20.32,55.24 0 top
C12  20.32,58.42 0 top
C13  47.62,12.06 90 top
C14  43.04,12.06 270 top
C15  46.04,12.06 270 top
C16  44.51,12.06 270 top
C17  59.37,12.7 270 top
C18  50.74,12.06 90 top
C19  52.26,12.06 90 top
C20  12.7,66.67 0 top
C21  49.3,8.26 90 top
C22  50.8,8.26 90 top
C23  52.32,8.26 90 top
C24  55.88,21.91 0 top
CR1  10.74,68.96 180 top
D1  25.4,36.2 0 top
D2  55.24,27.94 180 top
J1  77.47,36.83 180 top
J2  6.35,52.07 90 top
J3  1.27,26.67 90 top
J4  6.35,26.67 90 top
J5  1.27,52.07 90 top
J6  68.58,3.81 180 top
J10  23.5,76.2 0 top
J11  15.88,10.79 180 top
JP1  45.4,40.64 270 top
JP2  48.58,40.64 90 top
JP4  45.4,44.77 90 top
JP5  48.58,44.77 90 top
L1  72.07,15.88 270 top
LED1  76.2,43.81 0 top
LED2  76.2,41.76 0 top
LED3  44.45,3.17 270 top
LED4  45.72,3.17 270 top
LED5  45.72,67.94 0 top
LED6  21.91,19.37 180 top
M01  15.24,45.09 270 top
M02  15.24,20.32 270 top
M11  12.7,45.09 270 top
M12  12.7,20.32 270 top
Q1  31.11,36.2 90 top
Q2  35.56,36.2 90 top
R1  46.04,23.18 90 top
R2  12.7,62.23 90 top
R3  9.19,49.05 270 top
R4  11.43,62.23 90 top
R5  13.97,62.23 90 top
R6  10.46,49.02 270 top
R7  72.39,41.71 0 top
R8  20.32,53.98 0 top
R9  15.24,62.23 90 top
R10  12.57,37.69 90 top
R11  44.31,8.26 270 top
R12  46.35,8.26 270 top
R13  8.89,66.67 180 top
R14  34.62,41.91 90 top
R15  10.16,23.81 0 top
R16  11.3,37.67 90 top
R17  13.94,37.72 90 top
R18  21.06,27.94 0 top
R19  15.14,37.72 90 top
R20  72.39,43.81 0 top
R21  45.72,69.85 180 top
R22  40.01,42.57 0 top
R23  30.25,41.91 90 top
R24  5.08,15.56 180 top
R25  21.91,21.59 0 top
R26  32.44,41.91 90 top
R27  40.01,40.39 0 top
R28  28.09,41.91 90 top
R29  25.91,41.91 90 top
R30  22.23,66.04 180 top
R31  16.51,66.67 180 top
R32  23.7,41.91 90 top
R33  61.59,20.95 90 top
R34  63.5,20.95 90 top
S3  15.88,75.56 0 top
TM1  19.68,36.83 180 top
TM2  20.32,62.23 180 top
U1  59.69,71.12 90 top
U2  59.69,45.72 270 top
U3  36.2,7.62 270 top
U4  13.97,30.48 0 top
U5  13.97,55.88 0 top
U6  34.29,58.42 0 top
U7  34.92,24.77 0 top
U8  55.88,3.81 0 top
U9  40.01,76.2 180 top
U10  11.11,4.45 180 top
U$1  57.78,58.42 270 top
U$2  [LOGO-L]  78.74,60.96 270 bottom
U$3  46.99,17.78 270 top
U$4  [SRM-LOGO-M]  20.32,72.39 270 bottom
VR1  70.48,28.26 0 top
X1  77.47,58.42 90 top
Y1  27.3,22.23 270 top

### Tracks (layer width: path | path; a pad name or v marks a point on that pad's centre or on a via)
+3V3  (via drill 0.35)
  Top 0.305: R22.2 R27.2 40.85,38.31 v40.64,38.1 | R13.2 8.04,65.62 8.89,64.77 14.61,64.77 15.24,65.41 | 15.24,65.41 15.66,65.83 R31.2 | C14.1 C16.1 C15.1 46.04,13.65 v46.99,14.61 47.94,15.55 U$3.5 48.39,16.64 50.16,18.41 50.16,20.41 | S3.3 21.38,70.56 R30.2 | R30.2 20.74,65.41 15.24,65.41 | U6.VCC 25.99,49.58 v27.3,48.26 | v19.68,66.67 20.32,66.04 R30.2 | 50.16,20.41 48.25,22.33 C3.1 | 50.16,20.41 50.16,25.4 v40.64,34.92 40.02,35.55 Q2.1 36.48,35.22 35.56,34.29 33.3,34.29 Q1.1 31.75,35.26 v31.75,33.66 | D1.A 26.9,38.33 v27.3,38.73 | LED4.A 47.62,4.33 v47.62,5.71
  Bottom 0.305: v19.68,66.67 25.4,60.96 25.4,50.16 v27.3,48.26 28.57,46.99 28.57,40.01 v27.3,38.73 31.75,34.29 v31.75,33.66 | v40.64,38.1 v40.64,34.92 | v47.62,5.71 46.99,6.35 v46.99,14.61
+5V  (via drill 0.35)
  Top 0.305: M02.2 M12.2 10.57,17.78 5.71,17.78 4.18,16.24 4.18,15.61 | R24.2 4.18,15.61 | 4.18,15.61 2.54,17.25 C6.+ | C13.1 C1.1 C18.1 C19.1 52.92,11.21 v53.34,10.79 | M01.2 M11.2 10.57,42.55 5,42.55 C7.+ | R19.2 15.24,38.47 v15.24,42.55 M01.2 | M01.2 17.08,44.68 18.59,46.18 | 18.59,46.18 20.97,48.57 R8.2 21.2,54.2 C11.2 22.23,56.27 v22.23,56.52 | M02.2 16.1,19.91 v17.14,20.95 | R18.2 21.71,25.52 19.68,23.5 v19.68,21.59 | U7.6 31.75,23.57 32.14,23.18 35.88,23.18 | 35.88,23.18 36.29,22.77 U7.18 v41.18,22.77 41.91,23.5 41.91,24.13 43.18,25.4 45.72,25.4 46.04,25.08 R1.2 | 35.88,23.18 33.89,25.16 U7.4 24.48,25.16 R18.2 | 18.59,46.18 27.48,46.18 30.25,43.41 R23.2 R26.2 32.44,44.5 v33.02,45.09 | v15.88,64.14 15.26,63.52 15.24,63.52 R9.2 | J11.2 19.05,9.53 | 19.05,9.53 23.5,5.08 U3.3 25.82,4.38 C4.1 25.82,2.1 26.67,1.25 43.27,1.25 LED3.A | M02.2 15.24,19.68 20.32,14.61 20.32,10.79 19.05,9.53 | U$3.1 47.94,20 v48.26,20.32 | R18.2 21.71,29.19 C9.2 23,30.48 v23.5,30.48 | U$1.24 64.77,55.88 v63.5,57.15
  Bottom 0.305: v15.88,64.14 17.48,64.14 22.27,59.34 22.27,56.56 v22.23,56.52 | v41.18,22.77 43.62,20.32 v48.26,20.32 48.26,15.88 v53.34,10.79 | v63.5,57.15 61.59,59.05 48.9,59.05 47.62,57.78 47.62,55.24 41.91,49.53 37.47,49.53 v33.02,45.09 | v23.5,30.48 23.5,34.29 v15.24,42.55 | v19.68,21.59 17.78,21.59 v17.14,20.95
+20V
  Top 1.016: D2.C 58.28,22.75 C24.+ 58.38,21.8 R33.2
+24V  (via drill 0.35)
  Top 0.305: U1.10 64.77,74.3 73.14,65.92 X1.16 76.32,65.92 78.74,63.5 78.74,55.24 v76.42,52.92 X1.3 | U2.10 54.61,38.73 56.52,36.83 J1.2 74.93,38.1 75.56,38.73 76.83,38.73 78.11,40.01 78.11,43.18 77.47,43.81 LED1.A 76.95,45.6 v76.83,45.72
  Bottom 0.305: v76.83,45.72 76.42,46.14 v76.42,52.92
A0  (via drill 0.35)
  Top 0.305: U7.23 44.55,26.77 v45.09,27.3 | v54.61,56.52 53.34,57.78 U$1.10
  Bottom 0.305: v45.09,27.3 50.8,27.3 53.98,30.48 53.98,55.88 v54.61,56.52
A1  (via drill 0.35)
  Top 0.305: U7.24 42.8,27.57 v43.81,28.57 | v52.07,56.52 U$1.11
  Bottom 0.305: v43.81,28.57 50.16,28.57 52.07,30.48 v52.07,56.52
A2  (via drill 0.35)
  Top 0.305: U$1.14 52.07,51.44 53.34,50.16 53.34,36.2 v48.9,31.75 | v42.55,29.84 38.51,29.84 U7.25
  Bottom 0.305: v48.9,31.75 47.62,30.48 43.18,30.48 v42.55,29.84
A3  (via drill 0.35)
  Top 0.305: U7.26 36.92,30.57 38.1,31.75 v41.27,31.75 | v46.35,31.75 52.07,37.47 52.07,49.53 50.8,50.8 U$1.13
  Bottom 0.305: v41.27,31.75 v46.35,31.75
BOOST_FB  (via drill 0.35)
  Top 1.016: VR1.5 64.36,22.66 R34.2 63.5,22.86 v62.87,23.5 | R33.1 v61.59,18.41
  Bottom 1.016: v61.59,18.41 61.59,22.23 v62.87,23.5
DIR1  (via drill 0.35)
  Top 0.305: U4.12 12.7,25.38 v12.7,24.77 | v24.13,27.94 24.13,28.57 26.67,31.11 31.34,31.11 32.12,30.33 U7.32
  Bottom 0.305: v24.13,27.94 20.95,24.77 v12.7,24.77
DIR2  (via drill 0.35)
  Top 0.305: U5.12 10.79,51.93 v10.79,51.44 | U7.2 27.73,26.77 v27.34,26.36
  Bottom 0.305: v10.79,51.44 12.7,49.53 12.7,42.55 21.59,33.66 21.59,30.48 22.86,29.21 25.4,29.21 27.34,27.27 v27.34,26.36
DTR  (via drill 0.35)
  Top 0.305: C20.1 11.85,68.95 CR1.1 15.61,68.96 C8.1 15.66,71.54 v16.51,72.39
  Bottom 0.305: v16.51,72.39 22.23,78.11 34.92,78.11 36.2,76.83 J10.6
ENB  (via drill 0.35)
  Top 0.305: U5.10 12.44,53.6 12.7,53.34 12.7,51.44 10.94,49.67 R6.1 11.16,49.67 11.94,48.9 11.94,47.98 10.81,46.86 v10.46,46.86 | U4.10 12.44,28.2 13.34,27.3 v13.34,26.67
  Bottom 0.305: v13.34,26.67 16.51,29.84 16.51,36.2 10.46,42.24 v10.46,46.86
ESPRST  (via drill 0.35)
  Top 0.305: R31.1 C8.2 18.83,70.48 v19.05,70.48 | U9.2 38.1,74.3 26.04,74.3 v23.5,71.75 23.5,68.58 25.4,66.67 25.4,64.77 25.95,64.22 U6.RESET
  Bottom 0.305: v19.05,70.48 20.32,71.75 v23.5,71.75
ESPRX  (via drill 0.35)
  Top 0.305: U6.RXD0 45.73,62.22 46.99,60.96 46.99,44.45 46.49,43.95 JP4.1 44.59,43.95 v43.81,43.18 | JP1.2 43.81,40.64 v43.18,40.01
  Bottom 0.305: v43.18,40.01 43.18,42.55 v43.81,43.18
ESPTX
  Top 0.305: JP2.2 50.16,40.64 50.8,41.27 50.8,43.18 | 50.8,43.18 50.02,43.95 JP5.1 | U6.TXD0 46.27,64.22 48.26,62.23 48.26,51.44 50.8,48.9 50.8,43.18
GND  (via drill 0.35)
  Top 0.305: U5.EPAD 15.6,57.51 U5.21 18.14,57.51 v18.41,57.78 | U7.5 32.15,24.36 v32.38,24.13 | v33.02,26.67 32.31,25.96 U7.3 | R16.2 9.94,38.32 v8.89,39.37 | v7.62,63.5 8.24,62.88 R4.2 R2.2 R5.2
  Bottom 0.305: v32.38,24.13 32.38,26.04 v33.02,26.67 | v18.41,57.78 18.41,59.05 15.88,61.59 9.53,61.59 v7.62,63.5
  pour Top (isolate 0.254): 0,80.01 80.01,80.01 80.01,0 0,0
  pour Bottom (isolate 0.406, hatched): 0,80.01 80.96,80.01 80.96,0 0,0
GPIO0  (via drill 0.35)
  Top 0.305: S3.2 15.12,72.28 13.97,71.12 v10.79,71.12 9.63,69.95 CR1.2 9.63,66.79 R13.1 | U6.GPIO0 45.38,56.22 v45.72,55.88
  Bottom 0.305: v45.72,55.88 34.29,55.88 21.59,68.58 18.41,68.58 15.88,71.12 v10.79,71.12
IO12  (via drill 0.35)
  Top 0.305: U6.GPIO12 23.74,54.22 22.23,52.7 v22.23,48.26 | v24.13,45.09 25.91,43.31 R29.2
  Bottom 0.305: v22.23,48.26 22.23,46.99 v24.13,45.09
IO13  (via drill 0.35)
  Top 0.305: U6.GPIO13 24.28,52.22 23.5,51.44 23.5,49.53 v24.77,48.26 | v26.67,45.09 28.09,43.66 R28.2
  Bottom 0.305: v24.77,48.26 26.67,46.35 v26.67,45.09
IO16  (via drill 0.35)
  Top 0.305: R32.2 22.64,42.76 v21.59,43.81 | v23.5,57.78 23.93,58.22 U6.GPIO16
  Bottom 0.305: v21.59,43.81 20.32,45.09 20.32,48.9 23.5,52.07 v23.5,57.78
MEGARX  (via drill 0.35)
  Top 0.305: R26.1 32.44,39.95 v33.02,39.37 | v33.66,36.2 Q2.3 | JP4.3 45.4,46.67 v45.09,46.99 | U7.30 33.73,32.95 v33.66,33.02
  Bottom 0.305: v45.09,46.99 40.64,46.99 v33.02,39.37 33.02,36.83 v33.66,36.2 v33.66,33.02
MEGARXLV
  Top 0.305: JP2.1 JP1.3 42.42,36.84 Q2.2 36.48,38.39 38.48,40.39 R27.1
MEGATX  (via drill 0.35)
  Top 0.305: R23.1 30.19,41 v30.19,39.37 Q1.3 30.19,33.95 32.92,31.21 U7.31 | JP5.3 48.58,47.94 v48.9,48.26
  Bottom 0.305: v48.9,48.26 38.73,48.26 30.19,39.72 v30.19,39.37
MEGATXLV
  Top 0.305: JP2.3 JP1.1 43.64,41.45 42.55,42.55 42.55,43.81 41.91,44.45 40.01,44.45 39.16,43.6 R22.1 38.76,42.57 33.03,36.84 Q1.2
MISO  (via drill 0.35)
  Top 0.305: v38.1,18.41 37.73,18.79 U7.16
  Bottom 0.305: J11.1 20.32,12.06 22.23,13.97 31.11,13.97 35.56,18.41 v38.1,18.41
MOSI  (via drill 0.35)
  Top 0.305: U7.15 36.92,17.24 v36.83,17.14
  Bottom 0.305: v36.83,17.14 32.38,12.7 22.86,12.7 20.95,10.79 20.95,8.26 19.68,6.99 17.14,6.99 15.88,8.26 J11.4
N$1
  Top 1.016: L1.1 72.07,26.34 VR1.6 VR1.3 57.71,28.26 D2.A
N$3
  Top 0.305: U1.8 U$1.2
N$4
  Top 0.305: U1.7 U$1.3
N$5
  Top 0.305: U1.6 U$1.4
N$6
  Top 0.305: U1.5 U$1.5
N$7
  Top 0.305: U1.4 U$1.6
N$8
  Top 0.305: U1.3 U$1.7
N$9
  Top 0.305: U1.2 U$1.8
N$10
  Top 0.305: U1.1 U$1.9
N$11
  Top 0.305: U$1.23 63.5,52.7 64.77,51.44 U2.1
N$12
  Top 0.305: U$1.22 62.23,52.7 63.5,51.44 U2.2
N$13
  Top 0.305: U$1.21 60.96,52.7 62.23,51.44 U2.3
N$14
  Top 0.305: U$1.20 59.69,52.7 60.96,51.44 U2.4
N$15
  Top 0.305: U$1.19 58.42,52.7 59.69,51.44 U2.5
N$16
  Top 0.305: U$1.18 57.15,52.7 58.42,51.44 U2.6
N$17
  Top 0.305: J4.2 6.99,29.21 7.93,30.16 U4.7
  Bottom 0.508: J3.1 2.54,26.67 5.08,29.21 J4.2
N$18
  Top 0.305: J4.1 7.62,26.67 9.8,28.86 U4.9
  Top 0.508: J3.2 2.54,29.21 5.08,26.67 J4.1
N$19
  Top 0.305: U4.6 7.29,30.8 J4.3
  Top 0.508: J3.3 J4.3
N$20
  Top 0.305: J4.4 6.99,34.29 9.17,32.1 U4.4
  Top 0.508: J3.4 J4.4
N$21
  Top 0.305: X1.15 72.88,64.92 63.5,74.3 U1.11
N$22
  Top 0.305: X1.14 72.61,63.92 62.23,74.3 U1.12
N$23
  Top 0.305: X1.13 71.7,62.92 60.96,73.66 U1.13
N$24  (via drill 0.35)
  Top 0.305: X1.6 74.18,55.88 v71.75,55.88 | v59.69,70.48 U1.14
  Bottom 0.305: v71.75,55.88 71.12,56.52 71.12,60.96 61.59,70.48 v59.69,70.48
N$25  (via drill 0.35)
  Top 0.305: X1.5 72.7,54.92 v71.75,53.98 | v58.42,69.22 U1.15
  Bottom 0.305: v71.75,53.98 58.42,67.31 v58.42,69.22
N$26  (via drill 0.35)
  Top 0.305: U1.16 57.15,69.85 v56.52,69.22 | X1.4 72.95,53.92 71.75,52.73 v71.75,51.44
  Bottom 0.305: v56.52,69.22 56.52,66.67 v71.75,51.44
N$27  (via drill 0.35)
  Top 0.305: U1.17 v55.88,71.75 | v72.39,57.15 72.62,56.92 X1.7
  Bottom 0.305: v55.88,71.75 62.23,71.75 72.39,61.59 72.39,60.96 72.39,60.33 v72.39,57.15
N$28  (via drill 0.35)
  Top 0.305: X1.8 75.7,57.92 v76.83,59.05 | v53.98,73.03 54.61,73.66 U1.18
  Bottom 0.305: v53.98,73.03 62.87,73.03 v76.83,59.05
N$29
  Top 0.305: U$1.16 54.61,52.7 55.88,51.44 U2.8
N$30
  Top 0.305: U2.18 64.77,46.99 66.67,48.9 66.67,59.69 68.91,61.92 X1.12
N$31  (via drill 0.35)
  Top 0.305: U2.17 v63.5,47.62 | X1.11 74.18,60.96 69.85,60.96 67.94,59.05 67.94,48.26 v67.31,47.62
  Bottom 0.305: v63.5,47.62 v67.31,47.62
N$32  (via drill 0.35)
  Top 0.305: U2.16 v62.23,46.35 | v68.58,46.35 69.22,46.99 69.22,58.42 70.72,59.92 X1.10
  Bottom 0.305: v62.23,46.35 v68.58,46.35
N$33  (via drill 0.35)
  Top 0.305: U2.15 v60.96,44.45 | v70.48,46.35 70.48,57.78 71.62,58.92 X1.9
  Bottom 0.305: v60.96,44.45 68.58,44.45 v70.48,46.35
N$34
  Top 0.305: U$1.17 55.88,52.7 57.15,51.44 U2.7
N$35
  Top 0.305: J2.1 6.35,52.4 7.88,53.93 7.88,54.98 8.45,55.55 U5.7
  Top 0.508: J5.2 2.54,54.61 5.08,52.07 J2.1
N$36  (via drill 0.35)
  Top 0.305: U5.9 10.22,54.26 v9.65,53.68
  Bottom 0.305: v9.65,53.68 8.72,54.61 J2.2
  Bottom 0.508: J5.1 2.54,52.07 5.08,54.61 J2.2
N$38
  Top 0.305: U$3.4 44.51,18.16 C2.1
N$39
  Top 0.305: U$3.3 R1.1
N$40
  Top 0.305: J2.3 7.29,56.2 U5.6
  Top 0.508: J5.3 J2.3
N$41
  Top 0.305: U5.4 9.17,57.51 6.99,59.69 J2.4
  Top 0.508: J5.4 J2.4
N$42
  Top 0.305: U5.17 19.11,54.91 C11.1
N$43
  Top 0.305: R5.1 13.97,60.37 13.92,60.33 13.92,59.74 13.97,59.69 13.09,58.8 U5.2
N$44
  Top 0.305: U5.3 9.79,58.16 8.89,59.05 8.89,59.69 9.53,60.33 12.06,60.33 12.7,60.96 R2.1
N$45
  Top 0.305: R7.2 75.4,41.71 LED2.C
N$46
  Top 0.305: R3.1 8.41,50.48 8.41,53.28 8.66,53.53 8.66,54.46 9.1,54.91 U5.8
N$47  (via drill 0.35)
  Top 0.305: R4.1 8.88,61.58 v8.26,60.96 | v8.26,57.15 8.55,56.85 U5.5
  Bottom 0.305: v8.26,60.96 v8.26,57.15
N$48  (via drill 0.35)
  Top 0.305: v15.24,60.33 R9.1 | U5.1 9.76,59.45 v9.69,59.52
  Bottom 0.305: v9.69,59.52 14.44,59.52 v15.24,60.33
N$49
  Top 0.305: U5.16 18.55,54.26 18.83,53.98 R8.1
N$50
  Top 0.305: LED3.C 44.31,4.07 R11.2
N$51
  Top 0.305: LED4.C 46.35,4.56 R12.2
N$52
  Top 0.305: R30.1 23.07,61.38 24.23,60.22 U6.CH_PD
N$54
  Top 0.305: R17.1 13.95,34.9 12.45,33.41 U4.2
N$55
  Top 0.305: LED6.C 22.66,21.49 R25.2
N$56
  Top 0.305: LED5.C 44.97,69.75 R21.2
N$57
  Top 0.305: LED6.A 21.16,18.21 21.59,17.78 32.38,17.78 33.73,19.12 U7.11
N$58
  Top 0.305: Y1.3 29.21,21.02 29.69,21.02 U7.8
N$59
  Top 0.305: Y1.1 28.64,23.43 29.3,22.77 U7.7
N$60
  Top 0.305: D1.R 27.88,35.49 28.57,36.2 28.57,39.31 28.09,39.79 R28.1
N$61
  Top 0.305: D1.B 25.91,38.9 R29.1
N$62
  Top 0.305: D1.G 22.93,35.49 22.23,36.2 22.23,39.59 R32.1
N$65
  Top 0.305: R10.1 12.57,36.07 12.06,35.56 9.53,35.56 8.89,34.92 8.89,33.66 9.79,32.76 U4.3
N$66  (via drill 0.35)
  Top 0.305: U4.8 9.19,29.5 v8.26,28.57 | v8.26,24.77 9.21,23.81 R15.1
  Bottom 0.305: v8.26,28.57 v8.26,24.77
N$67  (via drill 0.35)
  Top 0.305: U4.5 8.55,31.45 v8.26,31.75 | v8.89,36.83 9.08,37.02 R16.1
  Bottom 0.305: v8.26,31.75 8.26,36.2 v8.89,36.83
N$68
  Top 0.305: U4.17 20.04,29.5 C9.1
N$72  (via drill 0.35)
  Top 0.305: J10.4 31.11,77.47 32.38,78.74 50.16,78.74 52.07,76.83 v52.07,72.39 | JP4.2 43.5,44.77 v43.18,45.09 | v57.15,60.33 v57.15,56.52 | v57.15,32.38 52.07,32.38 v50.8,31.11
  Bottom 0.305: v43.18,45.09 45.09,45.09 50.8,39.37 v50.8,31.11 | v52.07,72.39 52.07,65.41 v57.15,60.33 | v57.15,56.52 v57.15,32.38
N$73  (via drill 0.35)
  Top 0.305: R19.1 15.14,35.66 v15.24,35.56 | v10.16,34.29 10.39,34.05 U4.1
  Bottom 0.305: v15.24,35.56 13.97,34.29 v10.16,34.29
N$74
  Top 0.305: U4.16 18.77,28.86 19.68,27.94 R18.1
N$75
  Top 0.305: M01.1 16.77,47.02 U5.13
N$76
  Top 0.305: M11.1 13.97,46.76 13.97,52.07 14.86,52.95 U5.14
N$77
  Top 0.305: M02.1 16.77,22.26 U4.13
N$78
  Top 0.305: M12.1 12.7,22.23 14.61,24.13 14.61,26.67 15.49,27.55 U4.14
N$79
  Top 0.305: R20.2 LED1.C
N$80  (via drill 0.35)
  Top 0.305: U6.GPIO4 44.88,58.22 v45.09,58.42 | v46.35,66.67 46.35,67.83 LED5.A
  Bottom 0.305: v45.09,58.42 46.35,59.69 v46.35,66.67
N$81  (via drill 0.35)
  Top 0.305: JP5.2 49.8,44.77 v50.12,45.09 | v50.8,60.33 50.8,57.78 v49.53,56.52
  Bottom 0.305: v50.12,45.09 50.8,45.77 50.8,55.24 v49.53,56.52 | J10.5 33.66,74.93 35.56,73.03 46.99,73.03 50.48,69.53 50.8,69.22 v50.8,60.33
N$84
  Top 0.305: U6.GPIO15 44.3,52.22 45.09,51.44 45.09,48.9 41.91,45.72 36.2,45.72 34.62,44.15 R14.2
PULSE  (via drill 0.35)
  Top 0.305: LED2.A 76.95,40.76 76.2,40.01 v69.85,40.01 | v60.33,57.15 64.77,61.59 U$1.1 | v33.66,22.23 32.92,21.5 U7.10
  Bottom 0.305: v60.33,57.15 59.05,55.88 59.05,42.55 61.59,40.01 v69.85,40.01 55.24,25.4 36.83,25.4 v33.66,22.23
REF1
  Top 0.305: U4.22 U4.23 18.39,33.41 19.68,34.7 TM1.2
REF2
  Top 0.305: U5.22 U5.23 18.16,58.8 18.41,59.05 18.41,59.69 19.45,60.73 TM2.2
RST  (via drill 0.35)
  Top 0.305: R24.1 5.93,13.12 6.99,12.06 | 6.99,12.06 J11.5 | U10.2 11.11,7.94 6.99,12.06 | U7.29 34.52,30.71 v35.56,31.75 | v13.97,67.94 13.97,67.09 C20.2
  Bottom 0.305: J11.5 13.34,15.24 15.88,17.78 27.3,17.78 35.56,26.04 v35.56,31.75 31.75,31.75 19.05,44.45 19.05,50.16 20.95,52.07 20.95,59.05 17.14,62.87 15.24,62.87 13.97,64.14 v13.97,67.94
SCK  (via drill 0.35)
  Top 0.305: U7.17 39.22,17.63 37.47,15.88 v26.67,15.88
  Bottom 0.305: v26.67,15.88 17.78,15.88 15.88,13.97 J11.3
STEP1  (via drill 0.35)
  Top 0.305: U4.11 9.78,27.55 9.53,27.3 v9.53,26.04 | v25.4,26.67 26.3,27.57 U7.1
  Bottom 0.305: v9.53,26.04 12.06,23.5 22.23,23.5 v25.4,26.67
STEP2  (via drill 0.35)
  Top 0.305: U7.9 30.7,19.05 26.04,19.05 24.77,20.32 v24.77,22.86 | U5.11 10.16,52.95 9.53,52.32 v9.53,52.07
  Bottom 0.305: v24.77,22.86 26.04,22.86 28.57,25.4 28.57,27.94 24.77,31.75 24.77,34.29 13.97,45.09 13.97,50.8 12.06,52.7 10.16,52.7 v9.53,52.07
V_BATT
  Top 1.016: J6.4 59.05,3.81 57.15,5.71 54.61,5.71 53.39,4.5 U8.2
VCC  (via drill 0.35)
  Top 0.305: U5.19 16.77,55.88 U5.18 | U4.18 16.77,30.48 U4.19
  Top 0.508: 16.77,55.88 v17.78,55.88 | C5.1 24,12.83 18.41,18.41 v18.41,19.68 v18.41,26.04 | 16.77,30.48 v18.41,30.48
  Top 1.016: C5.1 25.82,10.86 U3.1 v23.5,10.16 | L1.2 69.69,8.45 v64.77,8.45 C17.+ 54.8,8.45 53.76,7.41 C23.1 C22.1 | C21.1 C22.1 | U8.1 50.8,3.91 C22.1 | VR1.4 61.48,26.56 v60.33,25.4
  Bottom 0.508: v17.78,55.88 17.78,43.18 30.48,30.48 30.48,24.77 25.4,19.68 v18.41,19.68 | v18.41,30.48 v18.41,26.04
  Bottom 1.016: v60.33,25.4 60.33,12.89 v64.77,8.45 | U8.1 29.84,3.81 v23.5,10.16
VINT1  (via drill 0.35)
  Top 0.305: C10.2 22.46,31.99 21.93,31.45 v20.32,31.45 U4.20 | U4.15 18.15,28.2 v20.32,26.04
  Bottom 0.305: v20.32,31.45 v20.32,26.04
VINT2  (via drill 0.35)
  Top 0.305: C12.2 21.2,57.39 20.66,56.85 v19.68,56.85 U5.20 | U5.15 18.15,53.6 v19.05,52.7
  Bottom 0.305: v19.05,52.7 19.68,53.34 v19.68,56.85
VREF1
  Top 0.305: TM1.3 17.7,38.66 16.77,37.73 U4.24
VREF2
  Top 0.305: TM2.3 18.34,64.06 16.77,62.49 16.77,60.96 U5.24

### Text on the board
tPlace: ETX | ERX | MRX | MTX
bPlace: Sprinter - Controller V6.0 | #karpeDiem